# Altium project AMC_FMC_Carrier v4.PrjPcb (part 18 of 18)
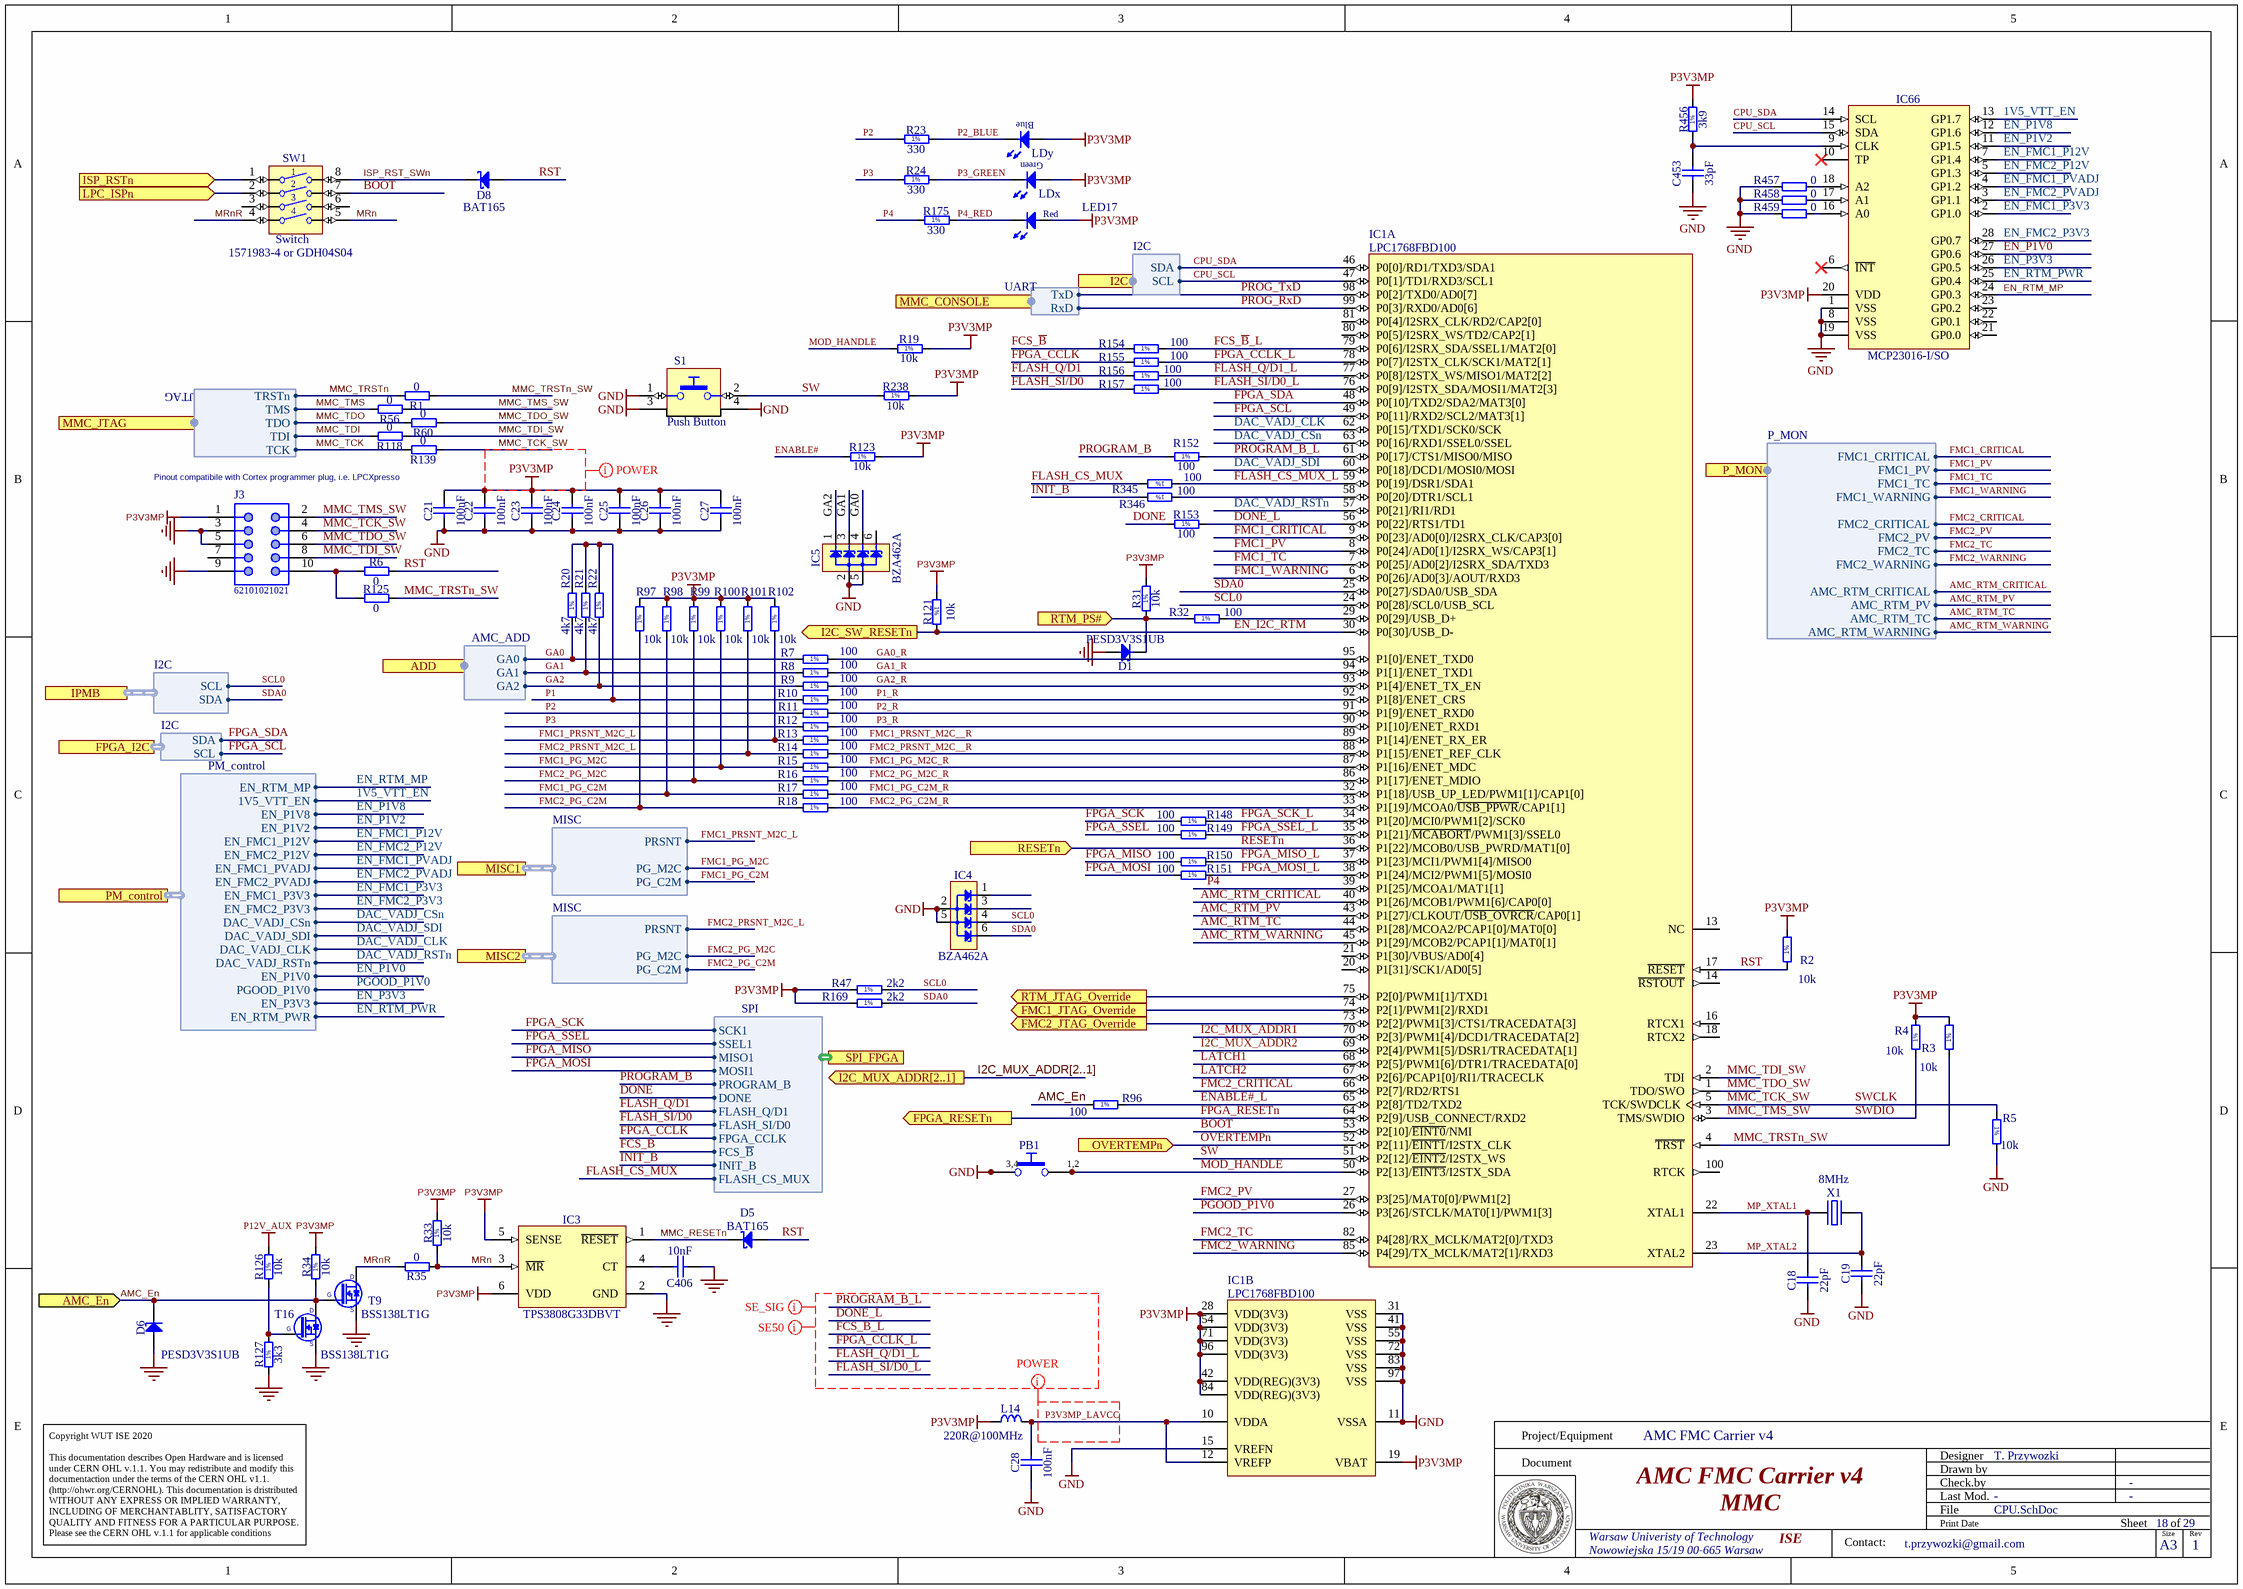
[diagram p31: CPU.SchDoc]

## Nets that join several sheets
FMC1_P3V3: HPC1 (10 pins), SUP_3.3_FMC (7 pins)
FMC2_P3V3: HPC2 (10 pins), SUP_3.3_FMC (7 pins)
GND: AMC_Connector (57 pins), HPC1 (182 pins), HPC2 (181 pins), FPGA (25 pins), FPGA_SDRAM (5 pins), FMC_HPC1 (16 pins), FMC_HPC2 (7 pins), FPGA_MGT (J18.2 J19.2 J20.2 J21.2), FPGA_SUP (499 pins), SDRAM (150 pins), POWER_Management (22 pins), SUP_2.5_FMC (38 pins), SUP_3.3_FMC (35 pins), SUP_1.5_3.3 (44 pins), SUP_1.2_1.8 (29 pins), SUP_1V (40 pins), UI_mon (10 pins), JTAG_Configuration (32 pins), RTM_CON (85 pins), M-LVDS PHY (64 pins), Clock_management (70 pins), Clock_WR (33 pins), AMC-SATA (6 pins), USB_SERIAL_QUAD (51 pins), I2C_MUX (7 pins), Thermometers (16 pins), RTCE (11 pins), CPU (45 pins)
MGTAVTT_G10: FPGA_MGT (R239.1), FPGA_SUP (21 pins)
MGTAVTT_G11: FPGA_MGT (R142.1), FPGA_SUP (21 pins)
P1V0: FPGA_SUP (123 pins), SUP_1V (24 pins)
P1V2: FPGA_SUP (FB7.1 FB8.1), SUP_1.2_1.8 (10 pins)
P1V5: FPGA_SUP (30 pins), SDRAM (108 pins), SUP_1.5_3.3 (12 pins), M-LVDS PHY (20 pins), Clock_management (C403.2 IC67.2 R439.1 R440.1)
P1V8: FPGA_SUP (L12.1), SUP_1.2_1.8 (10 pins)
P3V3: FPGA (26 pins), FMC_HPC1 (C102.1 LD1.4 R179.2), FPGA_SUP (C260.2 C261.2 IC2#2.L13 IC2#2.T11), POWER_Management (IC58.4 R268.2 R343.1 R344.1), SUP_1.5_3.3 (12 pins), JTAG_Configuration (18 pins), M-LVDS PHY (50 pins), Clock_management (7 pins), Clock_WR (8 pins), USB_SERIAL_QUAD (7 pins), I2C_MUX (11 pins)
P3V3_PMON: UI_mon (23 pins), I2C_MUX (R147.1 R265.1)
P3V3MP: AMC_Connector (P1.4), POWER_Management (6 pins), SUP_2.5_FMC (C475.2 C476.1 IC11.6 IC11.11), SUP_1.5_3.3 (R76.1), SUP_1.2_1.8 (R66.1 R77.1), SUP_1V (R110.2), UI_mon (L17.1), JTAG_Configuration (5 pins), USB_SERIAL_QUAD (IC61.1 R404.1 R405.2), I2C_MUX (8 pins), Thermometers (19 pins), RTCE (C38.1 C376.1 IC9.8 IC27.8), CPU (41 pins)
P12V: POWER_Management (18 pins), SUP_2.5_FMC (11 pins), SUP_3.3_FMC (11 pins), SUP_1.5_3.3 (11 pins), SUP_1.2_1.8 (6 pins), SUP_1V (18 pins)
P12V_AUX: POWER_Management (D7.2 D28.2 J4.3 J4.4), CPU (R126.2)
PAYLOAD_PWR: AMC_Connector (8 pins), POWER_Management (6 pins)
PVADJ1: HPC1 (8 pins), FPGA (6 pins), FMC_HPC1 (C100.1 IC25.2 R83.2 R178.2), FPGA_SUP (70 pins), SUP_2.5_FMC (6 pins)
PVADJ2: HPC2 (8 pins), FPGA (12 pins), FMC_HPC2 (R270.1), FPGA_SUP (69 pins), SUP_2.5_FMC (6 pins), Clock_management (7 pins)
VCCBATT: FPGA_SUP (BH1.1 C615.2 IC2#2.K13), RTCE (D4.2)
VREF: FPGA_SDRAM (8 pins), SDRAM (16 pins), SUP_1.5_3.3 (C548.2 IC44.6)
VTT: FPGA_SDRAM (R143.2 R181.2), SDRAM (40 pins), SUP_1.5_3.3 (5 pins)
3P3VAUX_R: AMC_FMC_Carrier (R124.2), HPC2 (J15B.c34)
ADD.GA0: AMC_Connector (P1.5), CPU (IC5.4 R7.1 R20.1)
ADD.GA1: AMC_Connector (P1.17), CPU (IC5.3 R8.1 R21.1)
ADD.GA2: AMC_Connector (P1.26), CPU (IC5.1 R9.1 R22.1)
AJTAG.TCK: AMC_Connector (P1.165), JTAG_Configuration (D12.1 IC46.9 R208.2)
AJTAG.TDI: AMC_Connector (P1.169), JTAG_Configuration (D10.1 IC46.4 R207.2)
AJTAG.TDO: AMC_Connector (P1.168), JTAG_Configuration (D13.1 IC46.7 R165.2)
AJTAG.TMS: AMC_Connector (P1.166), JTAG_Configuration (D11.1 IC46.12 R146.2)
AJTAG.TRST#: AMC_Connector (P1.167), JTAG_Configuration (D9.1 D14.1 R140.2 R229.2)
AMC_CLK_N: RTM_CON (J1.b3), Clock_management (R461.1)
AMC_CLK_P: RTM_CON (J1.a3), Clock_management (R460.1)
AMC_RTM_CRITICAL: UI_mon (R137.2 R465.1), CPU (IC1.40)
AMC_RTM_PV: UI_mon (R170.2 R464.1), CPU (IC1.43)
AMC_RTM_TC: UI_mon (R171.2 R463.1), CPU (IC1.44)
AMC_RTM_WARNING: UI_mon (R172.2 R462.1), CPU (IC1.45)
AMC_TCLK_N: RTM_CON (J1.b4), Clock_management (IC51#1.4)
AMC_TCLK_P: RTM_CON (J1.a4), Clock_management (IC51#1.3)
AUX_UART_Rx: FPGA (IC45.13), USB_SERIAL_QUAD (R396.1)
AUX_UART_Tx: FPGA (IC45.12), USB_SERIAL_QUAD (R398.1)
AUX_UART_VADJ2_Rx: FPGA (IC45.2), FMC_HPC2 (IC2#2.AD24 TP4.1)
AUX_UART_VADJ2_Tx: FPGA (IC45.3), FMC_HPC2 (IC2#2.AC24 TP13.1)
CLK2_BIDIR_N: HPC2 (J15B.k5), Clock_management (R355.1 R375.1)
CLK2_BIDIR_P: HPC2 (J15B.k4), Clock_management (R349.1 R376.1)
CLK3_BIDIR_N: HPC2 (J15B.j3), Clock_management (R366.1 R377.1)
CLK3_BIDIR_P: HPC2 (J15B.j2), Clock_management (R365.1 R378.1)
CLK_I2C.SCL: Clock_management (IC73.25), I2C_MUX (IC62.11 IC63.11 R424.2)
CLK_I2C.SDA: Clock_management (IC73.26), I2C_MUX (IC62.10 IC63.10 R423.2)
CLKS1.CLK0_M2C_N: HPC1 (J15A.h5), Clock_management (R360.1 R367.1)
CLKS1.CLK0_M2C_P: HPC1 (J15A.h4), Clock_management (R359.1 R368.1)
CLKS1.CLK1_M2C_N: HPC1 (J15A.g3), Clock_management (R299.1 R369.1)
CLKS1.CLK1_M2C_P: HPC1 (J15A.g2), Clock_management (R370.1 R443.1)
CLKS1.CLK2_BIDIR_N: HPC1 (J15A.k5), Clock_management (R362.1 R371.1)
CLKS1.CLK2_BIDIR_P: HPC1 (J15A.k4), Clock_management (R361.1 R372.1)
CLKS1.CLK3_BIDIR_N: HPC1 (J15A.j3), Clock_management (R364.1 R373.1)
CLKS1.CLK3_BIDIR_P: HPC1 (J15A.j2), Clock_management (R363.1 R374.1)
DP1.DP0_C2M_N: HPC1 (J15A.c3), FPGA_MGT (C179.1)
DP1.DP0_C2M_P: HPC1 (J15A.c2), FPGA_MGT (C178.1)
DP1.DP0_M2C_N: HPC1 (J15A.c7), FPGA_MGT (C181.1)
DP1.DP0_M2C_P: HPC1 (J15A.c6), FPGA_MGT (C180.1)
DP1.DP1_C2M_N: HPC1 (J15A.a23), FPGA_MGT (C185.1)
DP1.DP1_C2M_P: HPC1 (J15A.a22), FPGA_MGT (C184.1)
DP1.DP1_M2C_N: HPC1 (J15A.a3), FPGA_MGT (C187.1)
DP1.DP1_M2C_P: HPC1 (J15A.a2), FPGA_MGT (C186.1)
DP1.DP2_C2M_N: HPC1 (J15A.a27), FPGA_MGT (C191.1)
DP1.DP2_C2M_P: HPC1 (J15A.a26), FPGA_MGT (C190.1)
DP1.DP2_M2C_N: HPC1 (J15A.a7), FPGA_MGT (C193.1)
DP1.DP2_M2C_P: HPC1 (J15A.a6), FPGA_MGT (C192.1)
DP1.DP3_C2M_N: HPC1 (J15A.a31), FPGA_MGT (C195.1)
DP1.DP3_C2M_P: HPC1 (J15A.a30), FPGA_MGT (C194.1)
DP1.DP3_M2C_N: HPC1 (J15A.a11), FPGA_MGT (C197.1)
DP1.DP3_M2C_P: HPC1 (J15A.a10), FPGA_MGT (C196.1)
DP2.DP0_C2M_N: HPC2 (J15B.c3), FPGA_MGT (C199.1)
DP2.DP0_C2M_P: HPC2 (J15B.c2), FPGA_MGT (C198.1)
DP2.DP0_M2C_N: HPC2 (J15B.c7), FPGA_MGT (C201.1)
DP2.DP0_M2C_P: HPC2 (J15B.c6), FPGA_MGT (C200.1)
DP2.DP1_C2M_N: HPC2 (J15B.a23), FPGA_MGT (C205.1)
DP2.DP1_C2M_P: HPC2 (J15B.a22), FPGA_MGT (C204.1)
DP2.DP1_M2C_N: HPC2 (J15B.a3), FPGA_MGT (C207.1)
DP2.DP1_M2C_P: HPC2 (J15B.a2), FPGA_MGT (C206.1)
DP2.DP2_C2M_N: HPC2 (J15B.a27), FPGA_MGT (C629.1)
DP2.DP2_C2M_P: HPC2 (J15B.a26), FPGA_MGT (C627.1)
DP2.DP2_M2C_N: HPC2 (J15B.a7), FPGA_MGT (C633.1)
DP2.DP2_M2C_P: HPC2 (J15B.a6), FPGA_MGT (C631.1)
DP2.DP3_C2M_N: HPC2 (J15B.a31), FPGA_MGT (C628.1)
DP2.DP3_C2M_P: HPC2 (J15B.a30), FPGA_MGT (C626.1)
DP2.DP3_M2C_N: HPC2 (J15B.a11), FPGA_MGT (C632.1)
DP2.DP3_M2C_P: HPC2 (J15B.a10), FPGA_MGT (C630.1)
EN_I2C_RTM: I2C_MUX (IC63.24), CPU (IC1.30 R121.2)
EN_USB_JTAG: JTAG_Configuration (5 pins), USB_SERIAL_QUAD (T12.1)
FCLKA_N: AMC_Connector (P1.81), Clock_management (C776.1)
FCLKA_P: AMC_Connector (P1.80), Clock_management (C815.1)
FDDR.A0: FPGA_SDRAM (IC2#2.AP4), SDRAM (5 pins)
FDDR.A1: FPGA_SDRAM (IC2#2.AJ6), SDRAM (5 pins)
FDDR.A2: FPGA_SDRAM (IC2#2.AM4), SDRAM (5 pins)
FDDR.A3: FPGA_SDRAM (IC2#2.AM6), SDRAM (5 pins)
FDDR.A4: FPGA_SDRAM (IC2#2.AN4), SDRAM (5 pins)
FDDR.A5: FPGA_SDRAM (IC2#2.AK3), SDRAM (5 pins)
FDDR.A6: FPGA_SDRAM (IC2#2.AK5), SDRAM (5 pins)
FDDR.A7: FPGA_SDRAM (IC2#2.AP6), SDRAM (5 pins)
FDDR.A8: FPGA_SDRAM (IC2#2.AK6), SDRAM (5 pins)
FDDR.A9: FPGA_SDRAM (IC2#2.AL4), SDRAM (5 pins)
FDDR.A10: FPGA_SDRAM (IC2#2.AN2), SDRAM (5 pins)
FDDR.A11: FPGA_SDRAM (IC2#2.AJ8), SDRAM (5 pins)
FDDR.A12: FPGA_SDRAM (IC2#2.AP5), SDRAM (5 pins)
FDDR.A13: FPGA_SDRAM (IC2#2.AM7), SDRAM (5 pins)
FDDR.A14: FPGA_SDRAM (IC2#2.AK8), SDRAM (5 pins)
FDDR.A15: FPGA_SDRAM (IC2#2.AP3), SDRAM (5 pins)
FDDR.BA0: FPGA_SDRAM (IC2#2.AM2), SDRAM (5 pins)
FDDR.BA1: FPGA_SDRAM (IC2#2.AK2), SDRAM (5 pins)
FDDR.BA2: FPGA_SDRAM (IC2#2.AK1), SDRAM (5 pins)
FDDR.CAS_N: FPGA_SDRAM (IC2#2.AL2), SDRAM (5 pins)
FDDR.CE0_N: FPGA_SDRAM (IC2#2.AN3), SDRAM (5 pins)
FDDR.CKE0: FPGA_SDRAM (IC2#2.AJ5), SDRAM (5 pins)
FDDR.CLK0_N: FPGA_SDRAM (IC2#2.AM5), SDRAM (5 pins)
FDDR.CLK0_P: FPGA_SDRAM (IC2#2.AL5), SDRAM (5 pins)
FDDR.D0: FPGA_SDRAM (IC2#2.AD11), SDRAM (IC24.B3)
FDDR.D1: FPGA_SDRAM (IC2#2.AE10), SDRAM (IC24.C7)
FDDR.D2: FPGA_SDRAM (IC2#2.AF12), SDRAM (IC24.C2)
FDDR.D3: FPGA_SDRAM (IC2#2.AG11), SDRAM (IC24.C8)
FDDR.D4: FPGA_SDRAM (IC2#2.AE11), SDRAM (IC24.E3)
FDDR.D5: FPGA_SDRAM (IC2#2.AH11), SDRAM (IC24.E8)
FDDR.D6: FPGA_SDRAM (IC2#2.AG12), SDRAM (IC24.D2)
FDDR.D7: FPGA_SDRAM (IC2#2.AH9), SDRAM (IC24.E7)
FDDR.D8: FPGA_SDRAM (IC2#2.AD6), SDRAM (IC16.B3)
FDDR.D9: FPGA_SDRAM (IC2#2.AG7), SDRAM (IC16.C7)
FDDR.D10: FPGA_SDRAM (IC2#2.AF9), SDRAM (IC16.C2)
FDDR.D11: FPGA_SDRAM (IC2#2.AH7), SDRAM (IC16.C8)
FDDR.D12: FPGA_SDRAM (IC2#2.AE8), SDRAM (IC16.E3)
FDDR.D13: FPGA_SDRAM (IC2#2.AF8), SDRAM (IC16.E8)
FDDR.D14: FPGA_SDRAM (IC2#2.AE7), SDRAM (IC16.D2)
FDDR.D15: FPGA_SDRAM (IC2#2.AF7), SDRAM (IC16.E7)
FDDR.D16: FPGA_SDRAM (IC2#2.AF4), SDRAM (IC26.B3)
FDDR.D17: FPGA_SDRAM (IC2#2.AF5), SDRAM (IC26.C7)
FDDR.D18: FPGA_SDRAM (IC2#2.AD3), SDRAM (IC26.C2)
FDDR.D19: FPGA_SDRAM (IC2#2.AG5), SDRAM (IC26.C8)
FDDR.D20: FPGA_SDRAM (IC2#2.AD5), SDRAM (IC26.E3)
FDDR.D21: FPGA_SDRAM (IC2#2.AG6), SDRAM (IC26.E8)
FDDR.D22: FPGA_SDRAM (IC2#2.AD4), SDRAM (IC26.D2)
FDDR.D23: FPGA_SDRAM (IC2#2.AE3), SDRAM (IC26.E7)
FDDR.D24: FPGA_SDRAM (IC2#2.AG1), SDRAM (IC15.B3)
FDDR.D25: FPGA_SDRAM (IC2#2.AG2), SDRAM (IC15.C7)
FDDR.D26: FPGA_SDRAM (IC2#2.AE1), SDRAM (IC15.C2)
FDDR.D27: FPGA_SDRAM (IC2#2.AF3), SDRAM (IC15.C8)
FDDR.D28: FPGA_SDRAM (IC2#2.AE2), SDRAM (IC15.E3)
FDDR.D29: FPGA_SDRAM (IC2#2.AH3), SDRAM (IC15.E8)
FDDR.D30: FPGA_SDRAM (IC2#2.AD1), SDRAM (IC15.D2)
FDDR.D31: FPGA_SDRAM (IC2#2.AF2), SDRAM (IC15.E7)
FDDR.DQM0: FPGA_SDRAM (IC2#2.AD10), SDRAM (IC24.B7)
FDDR.DQM1: FPGA_SDRAM (IC2#2.AH6), SDRAM (IC16.B7)
FDDR.DQM2: FPGA_SDRAM (IC2#2.AG4), SDRAM (IC26.B7)
FDDR.DQM3: FPGA_SDRAM (IC2#2.AH1), SDRAM (IC15.B7)
FDDR.DQS0_N: FPGA_SDRAM (IC2#2.AG9), SDRAM (IC24.D3)
FDDR.DQS0_P: FPGA_SDRAM (IC2#2.AG10), SDRAM (IC24.C3)
FDDR.DQS1_N: FPGA_SDRAM (IC2#2.AD8), SDRAM (IC16.D3)
FDDR.DQS1_P: FPGA_SDRAM (IC2#2.AD9), SDRAM (IC16.C3)
FDDR.DQS2_N: FPGA_SDRAM (IC2#2.AJ4), SDRAM (IC26.D3)
FDDR.DQS2_P: FPGA_SDRAM (IC2#2.AH4), SDRAM (IC26.C3)
FDDR.DQS3_N: FPGA_SDRAM (IC2#2.AJ1), SDRAM (IC15.D3)
FDDR.DQS3_P: FPGA_SDRAM (IC2#2.AH2), SDRAM (IC15.C3)
FDDR.ODT0: FPGA_SDRAM (IC2#2.AP1), SDRAM (5 pins)
FDDR.RAS_N: FPGA_SDRAM (IC2#2.AN1), SDRAM (5 pins)
FDDR.RST_N: FPGA_SDRAM (IC2#2.AJ9), SDRAM (5 pins)
FDDR.WE_N: FPGA_SDRAM (IC2#2.AM1), SDRAM (5 pins)
FJTAG.TCK: FPGA (IC2#1.AE12), JTAG_Configuration (IC47.17 R164.1 R212.1)
FJTAG.TDI: FPGA (IC2#1.AE14), JTAG_Configuration (R209.1)
FJTAG.TDO: FPGA (IC2#1.AD13), JTAG_Configuration (R210.1 R235.2)
FJTAG.TMS: FPGA (IC2#1.AE13), JTAG_Configuration (IC47.11 R225.1 R436.1)
FLASH_CLK_C: FPGA (IC69.5), FMC_HPC1 (IC2#2.J8)
FMC1_CRITICAL: UI_mon (R173.2 R276.1), CPU (IC1.9)
FMC1_JTAG_Override: JTAG_Configuration (D22.2), CPU (IC1.74)
FMC1_PV: UI_mon (R174.2 R275.1), CPU (IC1.8)
FMC1_TC: UI_mon (R176.2 R274.1), CPU (IC1.7)
FMC1_WARNING: UI_mon (R273.2 R470.1), CPU (IC1.6)
FMC2_CRITICAL: UI_mon (R284.2 R469.1), CPU (IC1.66)
FMC2_JTAG_Override: JTAG_Configuration (D24.2), CPU (IC1.73)
FMC2_PV: UI_mon (R285.2 R468.1), CPU (IC1.27)
FMC2_TC: UI_mon (R313.2 R467.1), CPU (IC1.82)
FMC2_WARNING: UI_mon (R314.2 R466.1), CPU (IC1.85)
FMCC2.CLK0_M2C_N: HPC2 (J15B.h5), FMC_HPC2 (IC2#2.AB30)
FMCC2.CLK0_M2C_P: HPC2 (J15B.h4), FMC_HPC2 (IC2#2.AA30)
FMCC2.CLK1_M2C_N: HPC2 (J15B.g3), FMC_HPC2 (IC2#2.AG30)
FMCC2.CLK1_M2C_P: HPC2 (J15B.g2), FMC_HPC2 (IC2#2.AG29)
FMCC2.CLK2_BIDIR_N: FMC_HPC2 (IC2#2.AH29), Clock_management (R375.2)
FMCC2.CLK2_BIDIR_P: FMC_HPC2 (IC2#2.AH28), Clock_management (R376.2)
FMCC2.CLK3_BIDIR_N: FMC_HPC2 (IC2#2.Y31), Clock_management (R377.2)
FMCC2.CLK3_BIDIR_P: FMC_HPC2 (IC2#2.Y30), Clock_management (R378.2)
FPGA_CLK1_N: FPGA_MGT (C799.1), RTM_CON (J2.b5)
FPGA_CLK1_P: FPGA_MGT (C797.1), RTM_CON (J2.a5)
FPGA_CLK2_N: FPGA_MGT (C794.1), RTM_CON (J2.b9)
FPGA_CLK2_P: FPGA_MGT (C792.1), RTM_CON (J2.a9)
FPGA_CLK.BOOT_CLK_IN: FPGA_SDRAM (R311.2), Clock_WR (R51.2 R382.2)
FPGA_CLK.FPGA_CLK1_N: FPGA_SDRAM (IC2#2.AL7 R143.1), Clock_management (IC73.82)
FPGA_CLK.FPGA_CLK1_P: FPGA_SDRAM (IC2#2.AK7 R181.1), Clock_management (IC73.81)
FPGA_I2C_RST: FPGA (IC13.13), I2C_MUX (IC62.24 R417.2)
FPGA_I2C_SCL: FMC_HPC1 (IC25.6), I2C_MUX (B10.1 IC62.19 R412.1), CPU (IC1.49)
FPGA_I2C_SDA: FMC_HPC1 (IC25.5), I2C_MUX (B9.1 IC62.20 R411.1), CPU (IC1.48)
FPGA_RESETn: FMC_HPC2 (D3.1), CPU (IC1.64)
FSPI.DONE: FPGA (IC2#1.P11 Q9.1 R161.1), CPU (R153.2)
FSPI.FCS_~{B}: FPGA (IC13.12 R351.1), CPU (R154.1)
FSPI.FLASH_D2: FPGA (IC13.4), FMC_HPC2 (IC2#2.V26)
FSPI.FLASH_D3: FPGA (IC13.5), FMC_HPC2 (IC2#2.V27)
FSPI.FLASH_FCS_~{B}: FPGA (IC13.3), FMC_HPC2 (IC2#2.Y27)
FSPI.FLASH_Q/D1: FPGA (IC17.12 R298.2), CPU (R156.1)
FSPI.FLASH_Q/D1: FPGA (IC17.3), FMC_HPC2 (IC2#2.V29)
FSPI.FLASH_SI/D0: FPGA (IC17.13 R291.1), CPU (R157.1)
FSPI.FLASH_SI/D0: FPGA (IC17.2), FMC_HPC2 (IC2#2.V28)
FSPI.FPGA_CCLK: FPGA (IC2#1.W11 R294.1), CPU (R155.1)
FSPI.INIT_B: FPGA (IC2#1.V11 R131.2), CPU (R346.1)
FSPI.MISO1: FPGA (R296.2), CPU (R150.2)
FSPI.MOSI1: FPGA (R292.1), CPU (R151.2)
FSPI.PROGRAM_B: FPGA (IC2#1.N11 R160.1), CPU (R152.2)
FSPI.SCK1: FPGA (R295.1), CPU (R148.2)
FSPI.SSEL1: FPGA (R300.1), CPU (R149.2)
GBT1.GBTCLK0_M2C_N: HPC1 (J15A.d5), FPGA_MGT (C183.1)
GBT1.GBTCLK0_M2C_P: HPC1 (J15A.d4), FPGA_MGT (C182.1)
GBT1.GBTCLK1_M2C_N: HPC1 (J15A.b21), FPGA_MGT (C189.1)
GBT1.GBTCLK1_M2C_P: HPC1 (J15A.b20), FPGA_MGT (C188.1)
GBT2.GBTCLK0_M2C_N: HPC2 (J15B.d5), FPGA_MGT (C203.1)
GBT2.GBTCLK0_M2C_P: HPC2 (J15B.d4), FPGA_MGT (C202.1)
GBT2.GBTCLK1_M2C_N: HPC2 (J15B.b21), FPGA_MGT (C841.1)
GBT2.GBTCLK1_M2C_P: HPC2 (J15B.b20), FPGA_MGT (C840.1)
HA1.HA00_CC_N: HPC1 (J15A.f5), FMC_HPC1 (IC2#2.H29)
HA1.HA00_CC_P: HPC1 (J15A.f4), FMC_HPC1 (IC2#2.J29)
HA1.HA01_CC_N: HPC1 (J15A.e3), FMC_HPC1 (IC2#2.K28)
HA1.HA01_CC_P: HPC1 (J15A.e2), FMC_HPC1 (IC2#2.L28)
HA1.HA02_N: HPC1 (J15A.k8), FMC_HPC1 (IC2#2.J34)
HA1.HA02_P: HPC1 (J15A.k7), FMC_HPC1 (IC2#2.K33)
HA1.HA03_N: HPC1 (J15A.j7), FMC_HPC1 (IC2#2.J30)
HA1.HA03_P: HPC1 (J15A.j6), FMC_HPC1 (IC2#2.K30)
HA1.HA04_N: HPC1 (J15A.f8), FMC_HPC1 (IC2#2.L34)
HA1.HA04_P: HPC1 (J15A.f7), FMC_HPC1 (IC2#2.L33)
HA1.HA05_N: HPC1 (J15A.e7), FMC_HPC1 (IC2#2.H34)
HA1.HA05_P: HPC1 (J15A.e6), FMC_HPC1 (IC2#2.J33)
HA1.HA06_N: HPC1 (J15A.k11), FMC_HPC1 (IC2#2.K27)
HA1.HA06_P: HPC1 (J15A.k10), FMC_HPC1 (IC2#2.L27)
HA1.HA07_N: HPC1 (J15A.j10), FMC_HPC1 (IC2#2.K32)
HA1.HA07_P: HPC1 (J15A.j9), FMC_HPC1 (IC2#2.L32)
HA1.HA08_N: HPC1 (J15A.f11), FMC_HPC1 (IC2#2.L30)
HA1.HA08_P: HPC1 (J15A.f10), FMC_HPC1 (IC2#2.L29)
HA1.HA09_N: HPC1 (J15A.e10), FMC_HPC1 (IC2#2.J31)
HA1.HA09_P: HPC1 (J15A.e9), FMC_HPC1 (IC2#2.K31)
HA1.HA10_N: HPC1 (J15A.k14), FMC_HPC1 (IC2#2.G32)
HA1.HA10_P: HPC1 (J15A.k13), FMC_HPC1 (IC2#2.H32)
HA1.HA11_N: HPC1 (J15A.j13), FMC_HPC1 (IC2#2.L25)
HA1.HA11_P: HPC1 (J15A.j12), FMC_HPC1 (IC2#2.M25)
HA1.HA12_N: HPC1 (J15A.f14), FMC_HPC1 (IC2#2.G34)
HA1.HA12_P: HPC1 (J15A.f13), FMC_HPC1 (IC2#2.H33)
HA1.HA13_N: HPC1 (J15A.e13), FMC_HPC1 (IC2#2.J25)
HA1.HA13_P: HPC1 (J15A.e12), FMC_HPC1 (IC2#2.K25)
HA1.HA14_N: HPC1 (J15A.j16), FMC_HPC1 (IC2#2.L24)
HA1.HA14_P: HPC1 (J15A.j15), FMC_HPC1 (IC2#2.M24)
HA1.HA15_N: HPC1 (J15A.f17), FMC_HPC1 (IC2#2.G30)
HA1.HA15_P: HPC1 (J15A.f16), FMC_HPC1 (IC2#2.G29)
HA1.HA16_N: HPC1 (J15A.e16), FMC_HPC1 (IC2#2.G31)
HA1.HA16_P: HPC1 (J15A.e15), FMC_HPC1 (IC2#2.H31)
HA1.HA17_CC_N: HPC1 (J15A.k17), FMC_HPC1 (IC2#2.H28)
HA1.HA17_CC_P: HPC1 (J15A.k16), FMC_HPC1 (IC2#2.J28)
HA1.HA18_N: HPC1 (J15A.j19), FMC_HPC1 (IC2#2.G27)
HA1.HA18_P: HPC1 (J15A.j18), FMC_HPC1 (IC2#2.H27)
HA1.HA19_N: HPC1 (J15A.f20), FMC_HPC1 (IC2#2.G26)
HA1.HA19_P: HPC1 (J15A.f19), FMC_HPC1 (IC2#2.H26)
HA1.HA20_N: HPC1 (J15A.e19), FMC_HPC1 (IC2#2.J26)
HA1.HA20_P: HPC1 (J15A.e18), FMC_HPC1 (IC2#2.K26)
HA1.HA21_N: HPC1 (J15A.k20), FMC_HPC1 (IC2#2.G25)
HA1.HA21_P: HPC1 (J15A.k19), FMC_HPC1 (IC2#2.G24)
HA1.HA22_N: HPC1 (J15A.j22), FMC_HPC1 (IC2#2.H24)
HA1.HA22_P: HPC1 (J15A.j21), FMC_HPC1 (IC2#2.J24)
HA1.HA23_N: HPC1 (J15A.k23), FMC_HPC1 (IC2#2.J23)
HA1.HA23_P: HPC1 (J15A.k22), FMC_HPC1 (IC2#2.K23)
HA2.HA00_CC_N: HPC2 (J15B.f5), FMC_HPC2 (R245#1.16)
HA2.HA00_CC_P: HPC2 (J15B.f4), FMC_HPC2 (R245#1.15)
HA2.HA01_CC_N: HPC2 (J15B.e3), FMC_HPC2 (R245#1.14)
HA2.HA01_CC_P: HPC2 (J15B.e2), FMC_HPC2 (R245#1.13)
HA2.HA02_N: HPC2 (J15B.k8), FMC_HPC2 (R245#1.12)
HA2.HA02_P: HPC2 (J15B.k7), FMC_HPC2 (R245#1.11)
HA2.HA03_N: HPC2 (J15B.j7), FMC_HPC2 (R245#1.10)
HA2.HA03_P: HPC2 (J15B.j6), FMC_HPC2 (R245#1.9)
HA2.HA04_N: HPC2 (J15B.f8), FMC_HPC2 (R250#1.16)
HA2.HA04_P: HPC2 (J15B.f7), FMC_HPC2 (R250#1.15)
HA2.HA05_N: HPC2 (J15B.e7), FMC_HPC2 (R250#1.14)
HA2.HA05_P: HPC2 (J15B.e6), FMC_HPC2 (R250#1.13)
HA2.HA06_N: HPC2 (J15B.k11), FMC_HPC2 (R250#1.12)
HA2.HA06_P: HPC2 (J15B.k10), FMC_HPC2 (R250#1.11)
HA2.HA07_N: HPC2 (J15B.j10), FMC_HPC2 (R250#1.10)
HA2.HA07_P: HPC2 (J15B.j9), FMC_HPC2 (R250#1.9)
HA2.HA08_N: HPC2 (J15B.f11), FMC_HPC2 (R252#1.16)
HA2.HA08_P: HPC2 (J15B.f10), FMC_HPC2 (R252#1.15)
HA2.HA09_N: HPC2 (J15B.e10), FMC_HPC2 (R252#1.14)
HA2.HA09_P: HPC2 (J15B.e9), FMC_HPC2 (R252#1.13)
HA2.HA10_N: HPC2 (J15B.k14), FMC_HPC2 (R252#1.12)
HA2.HA10_P: HPC2 (J15B.k13), FMC_HPC2 (R252#1.11)
HA2.HA11_N: HPC2 (J15B.j13), FMC_HPC2 (R252#1.10)
HA2.HA11_P: HPC2 (J15B.j12), FMC_HPC2 (R252#1.9)
HA2.HA12_N: HPC2 (J15B.f14), FMC_HPC2 (R254#1.16)
HA2.HA12_P: HPC2 (J15B.f13), FMC_HPC2 (R254#1.15)
HA2.HA13_N: HPC2 (J15B.e13), FMC_HPC2 (R254#1.14)
HA2.HA13_P: HPC2 (J15B.e12), FMC_HPC2 (R254#1.13)
HA2.HA14_N: HPC2 (J15B.j16), FMC_HPC2 (IC2#2.AP34)
HA2.HA14_P: HPC2 (J15B.j15), FMC_HPC2 (IC2#2.AN34)
HA2.HA15_N: HPC2 (J15B.f17), FMC_HPC2 (IC2#2.AK30)
HA2.HA15_P: HPC2 (J15B.f16), FMC_HPC2 (IC2#2.AJ29)
HA2.HA16_N: HPC2 (J15B.e16), FMC_HPC2 (IC2#2.AL27)
HA2.HA16_P: HPC2 (J15B.e15), FMC_HPC2 (IC2#2.AK27)
HA2.HA17_CC_N: HPC2 (J15B.k17), FMC_HPC2 (IC2#2.AK28)
HA2.HA17_CC_P: HPC2 (J15B.k16), FMC_HPC2 (IC2#2.AJ28)
HA2.HA18_N: HPC2 (J15B.j19), FMC_HPC2 (IC2#2.AP33)
HA2.HA18_P: HPC2 (J15B.j18), FMC_HPC2 (IC2#2.AN33)
HA2.HA19_N: HPC2 (J15B.f20), FMC_HPC2 (IC2#2.AK31)
HA2.HA19_P: HPC2 (J15B.f19), FMC_HPC2 (IC2#2.AJ30)
HA2.HA20_N: HPC2 (J15B.e19), FMC_HPC2 (IC2#2.AK32)
HA2.HA20_P: HPC2 (J15B.e18), FMC_HPC2 (IC2#2.AJ31)
HA2.HA21_N: HPC2 (J15B.k20), FMC_HPC2 (IC2#2.AP30)
HA2.HA21_P: HPC2 (J15B.k19), FMC_HPC2 (IC2#2.AP29)
HA2.HA22_N: HPC2 (J15B.j22), FMC_HPC2 (IC2#2.AM34)
HA2.HA22_P: HPC2 (J15B.j21), FMC_HPC2 (IC2#2.AL34)
HA2.HA23_N: HPC2 (J15B.k23), FMC_HPC2 (IC2#2.AJ34)
HA2.HA23_P: HPC2 (J15B.k22), FMC_HPC2 (IC2#2.AJ33)
HB1.HB00_CC_N: HPC1 (J15A.k26), FMC_HPC1 (IC2#2.Y5)
HB1.HB00_CC_P: HPC1 (J15A.k25), FMC_HPC1 (IC2#2.W5)
HB1.HB01_N: HPC1 (J15A.j25), FMC_HPC1 (IC2#2.W8)
HB1.HB01_P: HPC1 (J15A.j24), FMC_HPC1 (IC2#2.W9)
HB1.HB02_N: HPC1 (J15A.f23), FMC_HPC1 (IC2#2.V8)
HB1.HB02_P: HPC1 (J15A.f22), FMC_HPC1 (IC2#2.V9)
HB1.HB03_N: HPC1 (J15A.e22), FMC_HPC1 (IC2#2.Y10)
HB1.HB03_P: HPC1 (J15A.e21), FMC_HPC1 (IC2#2.W10)
HB1.HB04_N: HPC1 (J15A.f26), FMC_HPC1 (IC2#2.Y7)
HB1.HB04_P: HPC1 (J15A.f25), FMC_HPC1 (IC2#2.Y8)
HB1.HB05_N: HPC1 (J15A.e25), FMC_HPC1 (IC2#2.AA9)
HB1.HB05_P: HPC1 (J15A.e24), FMC_HPC1 (IC2#2.AA10)
HB1.HB06_CC_N: HPC1 (J15A.k29), FMC_HPC1 (IC2#2.W4)
HB1.HB06_CC_P: HPC1 (J15A.k28), FMC_HPC1 (IC2#2.V4)
HB1.HB07_N: HPC1 (J15A.j28), FMC_HPC1 (IC2#2.AB9)
HB1.HB07_P: HPC1 (J15A.j27), FMC_HPC1 (IC2#2.AB10)
HB1.HB08_N: HPC1 (J15A.f29), FMC_HPC1 (IC2#2.W3)
HB1.HB08_P: HPC1 (J15A.f28), FMC_HPC1 (IC2#2.V3)
HB1.HB09_N: HPC1 (J15A.e28), FMC_HPC1 (IC2#2.V1)
HB1.HB09_P: HPC1 (J15A.e27), FMC_HPC1 (IC2#2.V2)
HB1.HB10_N: HPC1 (J15A.k32), FMC_HPC1 (IC2#2.V6)
HB1.HB10_P: HPC1 (J15A.k31), FMC_HPC1 (IC2#2.V7)
HB1.HB11_N: HPC1 (J15A.j31), FMC_HPC1 (IC2#2.Y1)
HB1.HB11_P: HPC1 (J15A.j30), FMC_HPC1 (IC2#2.W1)
HB1.HB12_N: HPC1 (J15A.f32), FMC_HPC1 (IC2#2.AC6)
HB1.HB12_P: HPC1 (J15A.f31), FMC_HPC1 (IC2#2.AC7)
HB1.HB13_N: HPC1 (J15A.e31), FMC_HPC1 (IC2#2.Y2)
HB1.HB13_P: HPC1 (J15A.e30), FMC_HPC1 (IC2#2.Y3)
HB1.HB14_N: HPC1 (J15A.k35), FMC_HPC1 (IC2#2.AC1)
HB1.HB14_P: HPC1 (J15A.k34), FMC_HPC1 (IC2#2.AC2)
HB1.HB15_N: HPC1 (J15A.j34), FMC_HPC1 (IC2#2.AC8)
HB1.HB15_P: HPC1 (J15A.j33), FMC_HPC1 (IC2#2.AC9)
HB1.HB16_N: HPC1 (J15A.f35), FMC_HPC1 (IC2#2.AB1)
HB1.HB16_P: HPC1 (J15A.f34), FMC_HPC1 (IC2#2.AB2)
HB1.HB17_CC_N: HPC1 (J15A.k38), FMC_HPC1 (IC2#2.AA4)
HB1.HB17_CC_P: HPC1 (J15A.k37), FMC_HPC1 (IC2#2.AA5)
HB1.HB18_N: HPC1 (J15A.j37), FMC_HPC1 (IC2#2.AB6)
HB1.HB18_P: HPC1 (J15A.j36), FMC_HPC1 (IC2#2.AB7)
HB1.HB19_N: HPC1 (J15A.e34), FMC_HPC1 (IC2#2.AB4)
HB1.HB19_P: HPC1 (J15A.e33), FMC_HPC1 (IC2#2.AB5)
HB1.HB20_N: HPC1 (J15A.f38), FMC_HPC1 (IC2#2.AA2)
HB1.HB20_P: HPC1 (J15A.f37), FMC_HPC1 (IC2#2.AA3)
HB1.HB21_N: HPC1 (J15A.e37), FMC_HPC1 (IC2#2.AC3)
HB1.HB21_P: HPC1 (J15A.e36), FMC_HPC1 (IC2#2.AC4)
HB2.HB00_CC_N: HPC2 (J15B.k26), FMC_HPC2 (R243.16)
HB2.HB00_CC_P: HPC2 (J15B.k25), FMC_HPC2 (R243.15)
HB2.HB01_N: HPC2 (J15B.j25), FMC_HPC2 (R243.14)
HB2.HB01_P: HPC2 (J15B.j24), FMC_HPC2 (R243.13)
HB2.HB02_N: HPC2 (J15B.f23), FMC_HPC2 (R243.12)
HB2.HB02_P: HPC2 (J15B.f22), FMC_HPC2 (R243.11)
HB2.HB03_N: HPC2 (J15B.e22), FMC_HPC2 (R243.10)
HB2.HB03_P: HPC2 (J15B.e21), FMC_HPC2 (R243.9)
HB2.HB04_N: HPC2 (J15B.f26), FMC_HPC2 (R387.16)
HB2.HB04_P: HPC2 (J15B.f25), FMC_HPC2 (R387.15)
HB2.HB05_N: HPC2 (J15B.e25), FMC_HPC2 (R387.14)
HB2.HB05_P: HPC2 (J15B.e24), FMC_HPC2 (R387.13)
HB2.HB06_CC_N: HPC2 (J15B.k29), FMC_HPC2 (R387.12)
HB2.HB06_CC_P: HPC2 (J15B.k28), FMC_HPC2 (R387.11)
HB2.HB07_N: HPC2 (J15B.j28), FMC_HPC2 (R387.10)
HB2.HB07_P: HPC2 (J15B.j27), FMC_HPC2 (R387.9)
HB2.HB08_N: HPC2 (J15B.f29), FMC_HPC2 (R389.16)
HB2.HB08_P: HPC2 (J15B.f28), FMC_HPC2 (R389.15)
HB2.HB09_N: HPC2 (J15B.e28), FMC_HPC2 (R389.14)
HB2.HB09_P: HPC2 (J15B.e27), FMC_HPC2 (R389.13)
HB2.HB10_N: HPC2 (J15B.k32), FMC_HPC2 (R389.12)
HB2.HB10_P: HPC2 (J15B.k31), FMC_HPC2 (R389.11)
HB2.HB11_N: HPC2 (J15B.j31), FMC_HPC2 (R389.10)
HB2.HB11_P: HPC2 (J15B.j30), FMC_HPC2 (R389.9)
HB2.HB12_N: HPC2 (J15B.f32), FMC_HPC2 (R391.16)
HB2.HB12_P: HPC2 (J15B.f31), FMC_HPC2 (R391.15)
HB2.HB13_N: HPC2 (J15B.e31), FMC_HPC2 (R391.14)
HB2.HB13_P: HPC2 (J15B.e30), FMC_HPC2 (R391.13)
HB2.HB14_N: HPC2 (J15B.k35), FMC_HPC2 (R391.12)
HB2.HB14_P: HPC2 (J15B.k34), FMC_HPC2 (R391.11)
HB2.HB15_N: HPC2 (J15B.j34), FMC_HPC2 (R391.10)
HB2.HB15_P: HPC2 (J15B.j33), FMC_HPC2 (R391.9)
HB2.HB16_N: HPC2 (J15B.f35), FMC_HPC2 (IC2#2.U32)
HB2.HB16_P: HPC2 (J15B.f34), FMC_HPC2 (IC2#2.U31)
HB2.HB17_CC_N: HPC2 (J15B.k38), FMC_HPC2 (R393.2)
HB2.HB17_CC_P: HPC2 (J15B.k37), FMC_HPC2 (R446.2)
HB2.HB18_N: HPC2 (J15B.j37), FMC_HPC2 (IC2#2.M29)
HB2.HB18_P: HPC2 (J15B.j36), FMC_HPC2 (IC2#2.N29)
HB2.HB19_N: HPC2 (J15B.e34), FMC_HPC2 (IC2#2.M31)
HB2.HB19_P: HPC2 (J15B.e33), FMC_HPC2 (IC2#2.M30)
Helper_OE: FPGA (Q14.3), Clock_WR (OSC3.2 R379.1)
Helper_OE_C: FPGA (R136.1), FPGA_SDRAM (IC2#2.AN6)
Helper_SCL: FPGA_SDRAM (IC2#2.AN7), Clock_management (IC67.3 R440.2)
Helper_SDA: FPGA_SDRAM (IC2#2.AC11), Clock_management (IC67.4 R439.2)
Helper_SI57X_SCL: Clock_management (IC67.6), Clock_WR (OSC3.8 R380.1)
Helper_SI57X_SDA: Clock_management (IC67.5), Clock_WR (OSC3.7 R381.1)
Helper_TUNE: Clock_management (IC41.15), Clock_WR (R383.2 R384.2)
I2C1.SCL: HPC1 (J15A.c30), I2C_MUX (IC62.17 IC63.17 R430.2)
I2C1.SDA: HPC1 (J15A.c31), I2C_MUX (IC62.16 IC63.16 R429.2)
I2C2.SCL: HPC2 (J15B.c30), I2C_MUX (IC62.15 IC63.15 R428.2)
I2C2.SDA: HPC2 (J15B.c31), I2C_MUX (IC62.14 IC63.14 R427.2)
I2C_CPU.SCL: I2C_MUX (B12.1 IC63.19 R432.1), CPU (IC1.47 IC66.15)
I2C_CPU.SDA: I2C_MUX (B11.1 IC63.20 R431.1), CPU (IC1.46 IC66.14)
I2C_FPGA_RST_C: FPGA (IC13.2), FMC_HPC2 (IC2#2.AD31)
I2C_MUX_ADDR1: I2C_MUX (R420.1 R434.1), CPU (IC1.70)
I2C_MUX_ADDR2: I2C_MUX (R418.1 R433.1), CPU (IC1.69)
I_AMC_P12V0+: POWER_Management (R?#4.E1), UI_mon (IC6.12)
I_AMC_P12V0-: POWER_Management (R?#4.E2), UI_mon (IC6.11)
I_FMC1_P3V3n: SUP_3.3_FMC (R94.E2), UI_mon (IC7.11)
I_FMC1_P3V3p: SUP_3.3_FMC (R94.E1), UI_mon (IC7.12)
I_FMC1_P12V0+: POWER_Management (R266.E1), UI_mon (IC7.15)
I_FMC1_P12V0-: POWER_Management (R266.E2), UI_mon (IC7.14)
I_FMC1_PADJn: SUP_2.5_FMC (R257.E2), UI_mon (IC7.1)
I_FMC1_PADJp: SUP_2.5_FMC (R257.E1), UI_mon (IC7.2)
I_FMC2_P3V3n: SUP_3.3_FMC (R89.E2), UI_mon (IC8.11)
I_FMC2_P3V3p: SUP_3.3_FMC (R89.E1), UI_mon (IC8.12)
I_FMC2_P12V0+: POWER_Management (R267.E1), UI_mon (IC8.15)
I_FMC2_P12V0-: POWER_Management (R267.E2), UI_mon (IC8.14)
I_FMC2_PADJn: SUP_2.5_FMC (R75.E2), UI_mon (IC8.1)
I_FMC2_PADJp: SUP_2.5_FMC (R75.E1), UI_mon (IC8.2)
I_RTM_P12V0+: POWER_Management (R68.E1), UI_mon (IC6.15)
I_RTM_P12V0-: POWER_Management (R68.E2), UI_mon (IC6.1 IC6.14)
IPMB.SCL: AMC_Connector (P1.56), CPU (IC1.24 IC4.4 R47.2)
IPMB.SDA: AMC_Connector (P1.71), CPU (IC1.25 IC4.6 R169.2)
ISP_RSTn: USB_SERIAL_QUAD (T13.3), CPU (SW1.1)
JTAG1.TCK: HPC1 (J15A.d29), JTAG_Configuration (IC47.16)
JTAG1.TDI: HPC1 (J15A.d30), JTAG_Configuration (IC49.1 R235.1)
JTAG1.TDO: HPC1 (J15A.d31), JTAG_Configuration (IC49.3)
JTAG1.TMS: HPC1 (J15A.d33), JTAG_Configuration (IC47.13)
JTAG2.TCK: HPC2 (J15B.d29), JTAG_Configuration (IC47.18)
JTAG2.TDI: HPC2 (J15B.d30), JTAG_Configuration (IC49.4 IC72.1)
JTAG2.TDO: HPC2 (J15B.d31), JTAG_Configuration (IC72.3)
JTAG2.TMS: HPC2 (J15B.d33), JTAG_Configuration (IC47.14)
LA1.LA00_CC_N: HPC1 (J15A.g7), FMC_HPC1 (IC2#2.K6)
LA1.LA00_CC_P: HPC1 (J15A.g6), FMC_HPC1 (IC2#2.K7)
LA1.LA01_CC_N: HPC1 (J15A.d9), FMC_HPC1 (IC2#2.J5)
LA1.LA01_CC_P: HPC1 (J15A.d8), FMC_HPC1 (IC2#2.J6)
LA1.LA02_N: HPC1 (J15A.h8), FMC_HPC1 (IC2#2.G6)
LA1.LA02_P: HPC1 (J15A.h7), FMC_HPC1 (IC2#2.G7)
LA1.LA03_N: HPC1 (J15A.g10), FMC_HPC1 (IC2#2.G1)
LA1.LA03_P: HPC1 (J15A.g9), FMC_HPC1 (IC2#2.H1)
LA1.LA04_N: HPC1 (J15A.h11), FMC_HPC1 (IC2#2.J1)
LA1.LA04_P: HPC1 (J15A.h10), FMC_HPC1 (IC2#2.K1)
LA1.LA05_N: HPC1 (J15A.d12), FMC_HPC1 (IC2#2.H3)
LA1.LA05_P: HPC1 (J15A.d11), FMC_HPC1 (IC2#2.H4)
LA1.LA06_N: HPC1 (J15A.c11), FMC_HPC1 (IC2#2.K5)
LA1.LA06_P: HPC1 (J15A.c10), FMC_HPC1 (IC2#2.L5)
LA1.LA07_N: HPC1 (J15A.h14), FMC_HPC1 (IC2#2.K2)
LA1.LA07_P: HPC1 (J15A.h13), FMC_HPC1 (IC2#2.K3)
LA1.LA08_N: HPC1 (J15A.g13), FMC_HPC1 (IC2#2.F2)
LA1.LA08_P: HPC1 (J15A.g12), FMC_HPC1 (IC2#2.F3)
LA1.LA09_N: HPC1 (J15A.d15), FMC_HPC1 (IC2#2.J3)
LA1.LA09_P: HPC1 (J15A.d14), FMC_HPC1 (IC2#2.J4)
LA1.LA10_N: HPC1 (J15A.c15), FMC_HPC1 (IC2#2.G2)
LA1.LA10_P: HPC1 (J15A.c14), FMC_HPC1 (IC2#2.H2)
LA1.LA11_N: HPC1 (J15A.h17), FMC_HPC1 (IC2#2.L2)
LA1.LA11_P: HPC1 (J15A.h16), FMC_HPC1 (IC2#2.M2)
LA1.LA12_N: HPC1 (J15A.g16), FMC_HPC1 (IC2#2.K8)
LA1.LA12_P: HPC1 (J15A.g15), FMC_HPC1 (IC2#2.L8)
LA1.LA13_N: HPC1 (J15A.d18), FMC_HPC1 (IC2#2.G9)
LA1.LA13_P: HPC1 (J15A.d17), FMC_HPC1 (IC2#2.G10)
LA1.LA14_N: HPC1 (J15A.c19), FMC_HPC1 (IC2#2.H8)
LA1.LA14_P: HPC1 (J15A.c18), FMC_HPC1 (IC2#2.H9)
LA1.LA15_N: HPC1 (J15A.h20), FMC_HPC1 (IC2#2.J11)
LA1.LA15_P: HPC1 (J15A.h19), FMC_HPC1 (IC2#2.K11)
LA1.LA16_N: HPC1 (J15A.g19), FMC_HPC1 (IC2#2.L9)
LA1.LA16_P: HPC1 (J15A.g18), FMC_HPC1 (IC2#2.L10)
LA1.LA17_CC_N: HPC1 (J15A.d21), FMC_HPC1 (IC2#2.T4)
LA1.LA17_CC_P: HPC1 (J15A.d20), FMC_HPC1 (IC2#2.T5)
LA1.LA18_CC_N: HPC1 (J15A.c23), FMC_HPC1 (IC2#2.P3)
LA1.LA18_CC_P: HPC1 (J15A.c22), FMC_HPC1 (IC2#2.P4)
LA1.LA19_N: HPC1 (J15A.h23), FMC_HPC1 (IC2#2.U4)
LA1.LA19_P: HPC1 (J15A.h22), FMC_HPC1 (IC2#2.U5)
LA1.LA20_N: HPC1 (J15A.g22), FMC_HPC1 (IC2#2.P10)
LA1.LA20_P: HPC1 (J15A.g21), FMC_HPC1 (IC2#2.R10)
LA1.LA21_N: HPC1 (J15A.h26), FMC_HPC1 (IC2#2.M6)
LA1.LA21_P: HPC1 (J15A.h25), FMC_HPC1 (IC2#2.M7)
LA1.LA22_N: HPC1 (J15A.g25), FMC_HPC1 (IC2#2.M4)
LA1.LA22_P: HPC1 (J15A.g24), FMC_HPC1 (IC2#2.M5)
LA1.LA23_N: HPC1 (J15A.d24), FMC_HPC1 (IC2#2.N2)
LA1.LA23_P: HPC1 (J15A.d23), FMC_HPC1 (IC2#2.N3)
LA1.LA24_N: HPC1 (J15A.h29), FMC_HPC1 (IC2#2.M10)
LA1.LA24_P: HPC1 (J15A.h28), FMC_HPC1 (IC2#2.M11)
LA1.LA25_N: HPC1 (J15A.g28), FMC_HPC1 (IC2#2.N7)
LA1.LA25_P: HPC1 (J15A.g27), FMC_HPC1 (IC2#2.N8)
LA1.LA26_N: HPC1 (J15A.d27), FMC_HPC1 (IC2#2.T2)
LA1.LA26_P: HPC1 (J15A.d26), FMC_HPC1 (IC2#2.T3)
LA1.LA27_N: HPC1 (J15A.c27), FMC_HPC1 (IC2#2.R2)
LA1.LA27_P: HPC1 (J15A.c26), FMC_HPC1 (IC2#2.R3)
LA1.LA28_N: HPC1 (J15A.h32), FMC_HPC1 (IC2#2.T7)
LA1.LA28_P: HPC1 (J15A.h31), FMC_HPC1 (IC2#2.T8)
LA1.LA29_N: HPC1 (J15A.g31), FMC_HPC1 (IC2#2.P8)
LA1.LA29_P: HPC1 (J15A.g30), FMC_HPC1 (IC2#2.P9)
LA1.LA30_N: HPC1 (J15A.h35), FMC_HPC1 (IC2#2.M1)
LA1.LA30_P: HPC1 (J15A.h34), FMC_HPC1 (IC2#2.N1)
LA1.LA31_N: HPC1 (J15A.g34), FMC_HPC1 (IC2#2.U6)
LA1.LA31_P: HPC1 (J15A.g33), FMC_HPC1 (IC2#2.U7)
LA1.LA32_N: HPC1 (J15A.h38), FMC_HPC1 (IC2#2.P1)
LA1.LA32_P: HPC1 (J15A.h37), FMC_HPC1 (IC2#2.R1)
LA1.LA33_N: HPC1 (J15A.g37), FMC_HPC1 (IC2#2.U1)
LA1.LA33_P: HPC1 (J15A.g36), FMC_HPC1 (IC2#2.U2)
LA2.LA00_CC_N: HPC2 (J15B.g7), FMC_HPC2 (IC2#2.AF28)
LA2.LA00_CC_P: HPC2 (J15B.g6), FMC_HPC2 (IC2#2.AE28)
LA2.LA01_CC_N: HPC2 (J15B.d9), FMC_HPC2 (IC2#2.AF30)
LA2.LA01_CC_P: HPC2 (J15B.d8), FMC_HPC2 (IC2#2.AF29)
LA2.LA02_N: HPC2 (J15B.h8), FMC_HPC2 (IC2#2.AH31)
LA2.LA02_P: HPC2 (J15B.h7), FMC_HPC2 (IC2#2.AG31)
LA2.LA03_N: HPC2 (J15B.g10), FMC_HPC2 (IC2#2.AH24)
LA2.LA03_P: HPC2 (J15B.g9), FMC_HPC2 (IC2#2.AG24)
LA2.LA04_N: HPC2 (J15B.h11), FMC_HPC2 (IC2#2.AC27)
LA2.LA04_P: HPC2 (J15B.h10), FMC_HPC2 (IC2#2.AC26)
LA2.LA05_N: HPC2 (J15B.d12), FMC_HPC2 (IC2#2.AH34)
LA2.LA05_P: HPC2 (J15B.d11), FMC_HPC2 (IC2#2.AH33)
LA2.LA06_N: HPC2 (J15B.c11), FMC_HPC2 (IC2#2.AF23)
LA2.LA06_P: HPC2 (J15B.c10), FMC_HPC2 (IC2#2.AE23)
LA2.LA07_N: HPC2 (J15B.h14), FMC_HPC2 (IC2#2.AH27)
LA2.LA07_P: HPC2 (J15B.h13), FMC_HPC2 (IC2#2.AG27)
LA2.LA08_N: HPC2 (J15B.g13), FMC_HPC2 (IC2#2.AE25)
LA2.LA08_P: HPC2 (J15B.g12), FMC_HPC2 (IC2#2.AD25)
LA2.LA09_N: HPC2 (J15B.d15), FMC_HPC2 (IC2#2.AG25)
LA2.LA09_P: HPC2 (J15B.d14), FMC_HPC2 (IC2#2.AF25)
LA2.LA10_N: HPC2 (J15B.c15), FMC_HPC2 (IC2#2.AH32)
LA2.LA10_P: HPC2 (J15B.c14), FMC_HPC2 (IC2#2.AG32)
LA2.LA11_N: HPC2 (J15B.h17), FMC_HPC2 (IC2#2.AE30)
LA2.LA11_P: HPC2 (J15B.h16), FMC_HPC2 (IC2#2.AD30)
LA2.LA12_N: HPC2 (J15B.g16), FMC_HPC2 (IC2#2.AF27)
LA2.LA12_P: HPC2 (J15B.g15), FMC_HPC2 (IC2#2.AE27)
LA2.LA13_N: HPC2 (J15B.d18), FMC_HPC2 (IC2#2.AG34)
LA2.LA13_P: HPC2 (J15B.d17), FMC_HPC2 (IC2#2.AF34)
LA2.LA14_N: HPC2 (J15B.c19), FMC_HPC2 (IC2#2.AF33)
LA2.LA14_P: HPC2 (J15B.c18), FMC_HPC2 (IC2#2.AE33)
LA2.LA15_N: HPC2 (J15B.h20), FMC_HPC2 (IC2#2.AD29)
LA2.LA15_P: HPC2 (J15B.h19), FMC_HPC2 (IC2#2.AD28)
LA2.LA16_N: HPC2 (J15B.g19), FMC_HPC2 (IC2#2.AD34)
LA2.LA16_P: HPC2 (J15B.g18), FMC_HPC2 (IC2#2.AD33)
LA2.LA17_CC_N: HPC2 (J15B.d21), FMC_HPC2 (IC2#2.AB32)
LA2.LA17_CC_P: HPC2 (J15B.d20), FMC_HPC2 (IC2#2.AB31)
LA2.LA18_CC_N: HPC2 (J15B.c23), FMC_HPC2 (IC2#2.W31)
LA2.LA18_CC_P: HPC2 (J15B.c22), FMC_HPC2 (IC2#2.W30)
LA2.LA19_N: HPC2 (J15B.h23), FMC_HPC2 (IC2#2.AB27)
LA2.LA19_P: HPC2 (J15B.h22), FMC_HPC2 (IC2#2.AB26)
LA2.LA20_N: HPC2 (J15B.g22), FMC_HPC2 (IC2#2.AB25)
LA2.LA20_P: HPC2 (J15B.g21), FMC_HPC2 (IC2#2.AB24)
LA2.LA21_N: HPC2 (J15B.h26), FMC_HPC2 (IC2#2.AA33)
LA2.LA21_P: HPC2 (J15B.h25), FMC_HPC2 (IC2#2.AA32)
LA2.LA22_N: HPC2 (J15B.g25), FMC_HPC2 (IC2#2.AA25)
LA2.LA22_P: HPC2 (J15B.g24), FMC_HPC2 (IC2#2.AA24)
LA2.LA23_N: HPC2 (J15B.d24), FMC_HPC2 (IC2#2.Y25)
LA2.LA23_P: HPC2 (J15B.d23), FMC_HPC2 (IC2#2.W25)
LA2.LA24_N: HPC2 (J15B.h29), FMC_HPC2 (IC2#2.Y33)
LA2.LA24_P: HPC2 (J15B.h28), FMC_HPC2 (IC2#2.Y32)
LA2.LA25_N: HPC2 (J15B.g28), FMC_HPC2 (IC2#2.AB29)
LA2.LA25_P: HPC2 (J15B.g27), FMC_HPC2 (IC2#2.AA29)
LA2.LA26_N: HPC2 (J15B.d27), FMC_HPC2 (IC2#2.AC32)
LA2.LA26_P: HPC2 (J15B.d26), FMC_HPC2 (IC2#2.AC31)
LA2.LA27_N: HPC2 (J15B.c27), FMC_HPC2 (IC2#2.AA28)
LA2.LA27_P: HPC2 (J15B.c26), FMC_HPC2 (IC2#2.AA27)
LA2.LA28_N: HPC2 (J15B.h32), FMC_HPC2 (IC2#2.W29)
LA2.LA28_P: HPC2 (J15B.h31), FMC_HPC2 (IC2#2.W28)
LA2.LA29_N: HPC2 (J15B.g31), FMC_HPC2 (IC2#2.AC34)
LA2.LA29_P: HPC2 (J15B.g30), FMC_HPC2 (IC2#2.AC33)
LA2.LA30_N: HPC2 (J15B.h35), FMC_HPC2 (IC2#2.W34)
LA2.LA30_P: HPC2 (J15B.h34), FMC_HPC2 (IC2#2.W33)
LA2.LA31_N: HPC2 (J15B.g34), FMC_HPC2 (IC2#2.V32)
LA2.LA31_P: HPC2 (J15B.g33), FMC_HPC2 (IC2#2.V31)
LA2.LA32_N: HPC2 (J15B.h38), FMC_HPC2 (IC2#2.AB34)
LA2.LA32_P: HPC2 (J15B.h37), FMC_HPC2 (IC2#2.AA34)
LA2.LA33_N: HPC2 (J15B.g37), FMC_HPC2 (IC2#2.V34)
LA2.LA33_P: HPC2 (J15B.g36), FMC_HPC2 (IC2#2.V33)
LPC_ISPn: USB_SERIAL_QUAD (IC61.4 R405.1), CPU (SW1.2)
MGT.FP2_CLK1_N: FPGA_MGT (C409.1), Clock_management (IC73.86)
MGT.FP2_CLK1_P: FPGA_MGT (C402.1), Clock_management (IC73.85)
MGT.FP2_CLK2_N: FPGA_MGT (C413.1), Clock_management (IC50#1.4)
MGT.LINK01_CLK_N: FPGA_MGT (C220.1), Clock_management (IC83.2)
MGT.LINK01_CLK_P: FPGA_MGT (C219.1), Clock_management (IC83.1)
MGT.LINK23_CLK_N: FPGA_MGT (C839.1), Clock_management (IC85.2)
MGT.LINK23_CLK_P: FPGA_MGT (C838.1), Clock_management (IC85.1)
MGT.PCIE_CLK1_N: FPGA_MGT (C463.1), Clock_management (IC50#1.2)
MGT.PCIE_CLK1_P: FPGA_MGT (C461.1), Clock_management (IC50#1.1)
MGT.PCIE_CLK2_P: FPGA_MGT (C411.1), Clock_management (IC50#1.3)
MISC1.PG_C2M: HPC1 (J15A.d1), CPU (R17.1 R98.1)
MISC1.PG_M2C: HPC1 (J15A.f1), CPU (R15.1 R100.1)
MISC1.PRSNT: HPC1 (J15A.h2), JTAG_Configuration (R237.2), CPU (R13.1 R102.1)
MISC2.PG_C2M: HPC2 (J15B.d1), CPU (R18.1 R97.1)
MISC2.PG_M2C: HPC2 (J15B.f1), CPU (R16.1 R99.1)
MISC2.PRSNT: HPC2 (J15B.h2), JTAG_Configuration (R241.2), CPU (R14.1 R101.1)
MLVDS_A.Rx17_N: AMC_Connector (P1.141), M-LVDS PHY (IC22.14)
MLVDS_A.Rx17_P: AMC_Connector (P1.142), M-LVDS PHY (IC22.13)
MLVDS_A.Rx18_N: AMC_Connector (P1.147), M-LVDS PHY (IC22.4)
MLVDS_A.Rx18_P: AMC_Connector (P1.148), M-LVDS PHY (IC22.3)
MLVDS_A.Rx19_N: AMC_Connector (P1.153), M-LVDS PHY (IC23.14)
MLVDS_A.Rx19_P: AMC_Connector (P1.154), M-LVDS PHY (IC23.13)
MLVDS_A.Rx20_N: AMC_Connector (P1.159), M-LVDS PHY (IC23.4)
MLVDS_A.Rx20_P: AMC_Connector (P1.160), M-LVDS PHY (IC23.3)
MLVDS_A.Tx17_N: AMC_Connector (P1.144), M-LVDS PHY (IC22.10)
MLVDS_A.Tx17_P: AMC_Connector (P1.145), M-LVDS PHY (IC22.9)
MLVDS_A.Tx18_N: AMC_Connector (P1.150), M-LVDS PHY (IC22.48)
MLVDS_A.Tx18_P: AMC_Connector (P1.151), M-LVDS PHY (IC22.47)
MLVDS_A.Tx19_N: AMC_Connector (P1.156), M-LVDS PHY (IC23.10)
MLVDS_A.Tx19_P: AMC_Connector (P1.157), M-LVDS PHY (IC23.9)
MLVDS_A.Tx20_N: AMC_Connector (P1.162), M-LVDS PHY (IC23.48)
MLVDS_A.Tx20_P: AMC_Connector (P1.163), M-LVDS PHY (IC23.47)
MLVDS_F.IO_RX_P17: FPGA_SDRAM (IC2#2.AM9), M-LVDS PHY (IC28.3)
MLVDS_F.IO_RX_P18: FPGA_SDRAM (IC2#2.AP10), M-LVDS PHY (IC34.3)
MLVDS_F.IO_RX_P19: FPGA_SDRAM (IC2#2.AN8), M-LVDS PHY (IC36.3)
MLVDS_F.IO_RX_P20: FPGA_SDRAM (IC2#2.AL8), M-LVDS PHY (IC38.3)
MLVDS_F.IO_TX_P17: FPGA_SDRAM (IC2#2.AP11), M-LVDS PHY (IC29.3)
MLVDS_F.IO_TX_P18: FPGA_SDRAM (IC2#2.AM11), M-LVDS PHY (IC35.3)
MLVDS_F.IO_TX_P19: FPGA_SDRAM (IC2#2.AP8), M-LVDS PHY (IC37.3)
MLVDS_F.IO_TX_P20: FPGA_SDRAM (IC2#2.AL9), M-LVDS PHY (IC39.3)
MLVDS_F.~{RE}_DE_RX_P17: FPGA_SDRAM (IC2#2.AJ10), M-LVDS PHY (IC28.5 IC40.10)
MLVDS_F.~{RE}_DE_RX_P18: FPGA_SDRAM (IC2#2.AJ11), M-LVDS PHY (IC34.5 IC40.8)
MLVDS_F.~{RE}_DE_RX_P19: FPGA_SDRAM (IC2#2.AM10), M-LVDS PHY (IC36.5 IC40.6)
MLVDS_F.~{RE}_DE_RX_P20: FPGA_SDRAM (IC2#2.AN9), M-LVDS PHY (IC38.5 IC40.4)
MLVDS_F.~{RE}_DE_TX_P17: FPGA_SDRAM (IC2#2.AK11), M-LVDS PHY (IC29.5 IC40.9)
MLVDS_F.~{RE}_DE_TX_P18: FPGA_SDRAM (IC2#2.AL10), M-LVDS PHY (IC35.5 IC40.7)
MLVDS_F.~{RE}_DE_TX_P19: FPGA_SDRAM (IC2#2.AN11), M-LVDS PHY (IC37.5 IC40.5)
MLVDS_F.~{RE}_DE_TX_P20: FPGA_SDRAM (IC2#2.AP9), M-LVDS PHY (IC39.5 IC40.3)
MMC_CONS_PROG_RxD: USB_SERIAL_QUAD (IC61.2), CPU (IC1.99)
MMC_CONS_PROG_TxD: USB_SERIAL_QUAD (IC61.3), CPU (IC1.98)
MMC_TCK: JTAG_Configuration (IC46.11), CPU (R139.2)
MMC_TDI: JTAG_Configuration (IC46.2), CPU (R118.2)
MMC_TDO: JTAG_Configuration (IC46.5), CPU (R60.2)
MMC_TMS: JTAG_Configuration (IC46.14), CPU (R56.2)
MMC_TRSTn: JTAG_Configuration (R229.1), CPU (R1.2)
NetIC2#1_W17: FPGA (IC2#1.W17), Thermometers (R135.1)
NetIC2#1_W18: FPGA (IC2#1.W18), Thermometers (IC18.3)
OVERTEMPn: Thermometers (6 pins), CPU (IC1.52)
PIPE1.Rx4_N: AMC_Connector (P1.48), FPGA_MGT (C337.1)
PIPE1.Rx4_P: AMC_Connector (P1.47), FPGA_MGT (C336.1)
PIPE1.Rx5_N: AMC_Connector (P1.54), FPGA_MGT (C341.1)
PIPE1.Rx5_P: AMC_Connector (P1.53), FPGA_MGT (C340.1)
PIPE1.Rx6_N: AMC_Connector (P1.63), FPGA_MGT (C349.1)
PIPE1.Rx6_P: AMC_Connector (P1.62), FPGA_MGT (C348.1)
PIPE1.Rx7_N: AMC_Connector (P1.69), FPGA_MGT (C345.1)
PIPE1.Rx7_P: AMC_Connector (P1.68), FPGA_MGT (C344.1)
PIPE1.Tx4_N: AMC_Connector (P1.45), FPGA_MGT (C335.1)
PIPE1.Tx4_P: AMC_Connector (P1.44), FPGA_MGT (C334.1)
PIPE1.Tx5_N: AMC_Connector (P1.51), FPGA_MGT (C339.1)
PIPE1.Tx5_P: AMC_Connector (P1.50), FPGA_MGT (C338.1)
PIPE1.Tx6_N: AMC_Connector (P1.60), FPGA_MGT (C347.1)
PIPE1.Tx6_P: AMC_Connector (P1.59), FPGA_MGT (C346.1)
PIPE1.Tx7_N: AMC_Connector (P1.66), FPGA_MGT (C343.1)
PIPE1.Tx7_P: AMC_Connector (P1.65), FPGA_MGT (C342.1)
PIPE2.Rx8_N: AMC_Connector (P1.87), FPGA_MGT (C321.1)
PIPE2.Rx8_P: AMC_Connector (P1.88), FPGA_MGT (C320.1)
PIPE2.Rx9_N: AMC_Connector (P1.93), FPGA_MGT (C325.1)
PIPE2.Rx9_P: AMC_Connector (P1.94), FPGA_MGT (C324.1)
PIPE2.Rx10_N: AMC_Connector (P1.99), FPGA_MGT (C329.1)
PIPE2.Rx10_P: AMC_Connector (P1.100), FPGA_MGT (C328.1)
PIPE2.Rx11_N: AMC_Connector (P1.105), FPGA_MGT (C333.1)
PIPE2.Rx11_P: AMC_Connector (P1.106), FPGA_MGT (C332.1)
PIPE2.Tx8_N: AMC_Connector (P1.90), FPGA_MGT (C319.1)
PIPE2.Tx8_P: AMC_Connector (P1.91), FPGA_MGT (C318.1)
PIPE2.Tx9_N: AMC_Connector (P1.96), FPGA_MGT (C323.1)
PIPE2.Tx9_P: AMC_Connector (P1.97), FPGA_MGT (C322.1)
PIPE2.Tx10_N: AMC_Connector (P1.102), FPGA_MGT (C327.1)
PIPE2.Tx10_P: AMC_Connector (P1.103), FPGA_MGT (C326.1)
PIPE2.Tx11_N: AMC_Connector (P1.108), FPGA_MGT (C331.1)
PIPE2.Tx11_P: AMC_Connector (P1.109), FPGA_MGT (C330.1)
PLL_CTRL.PLL_VADJ2_DAC1_SYNC_N: FMC_HPC2 (IC2#2.R25), Clock_management (IC41.5)
PLL_CTRL.PLL_VADJ2_DAC2_SYNC_N: FMC_HPC2 (IC2#2.AL24), Clock_management (IC41.3)
PLL_CTRL.PLL_VADJ2_DAC_DIN: FMC_HPC2 (IC2#2.AF24), Clock_management (IC41.6)
PLL_CTRL.PLL_VADJ2_DAC_SCLK: FMC_HPC2 (IC2#2.AJ24), Clock_management (IC41.4)
PLL_CTRL.VADJ2_Helper_TUNE: FMC_HPC2 (IC2#2.U24), Clock_management (IC41.9)
PLL_CTRL.VADJ2_SI57X_OE: FMC_HPC2 (IC2#2.AD23), Clock_management (IC41.7)
PLL_CTRL.VADJ2_SI57X_SCL: FMC_HPC2 (IC2#2.V24), Clock_management (IC42.3 R214.2)
PLL_CTRL.VADJ2_SI57X_SDA: FMC_HPC2 (IC2#2.W24), Clock_management (IC42.4 R271.2)
PLL_CTRL.VADJ2_SI57X_TUNE: FMC_HPC2 (IC2#2.T24), Clock_management (IC41.8)
PLL_DAC1_SYNC_N: Clock_management (IC41.19), Clock_WR (IC53.5)
PLL_DAC2_SYNC_N: Clock_management (IC41.21), Clock_WR (IC52.5)
PLL_DAC_DIN: Clock_management (IC41.18), Clock_WR (IC52.7 IC53.7 IC82.7)
PLL_DAC_SCLK: Clock_management (IC41.20), Clock_WR (IC52.6 IC53.6 IC82.6)
PM.1V5_VTT_EN: SUP_1.5_3.3 (IC43.24 R49.1), CPU (IC66.13)
PM.DAC_VADJ_CLK: SUP_2.5_FMC (IC11.9), CPU (IC1.62)
PM.DAC_VADJ_CSn: SUP_2.5_FMC (IC11.7), CPU (IC1.63)
PM.DAC_VADJ_RSTn: SUP_2.5_FMC (IC11.10), CPU (IC1.57)
PM.DAC_VADJ_SDI: SUP_2.5_FMC (IC11.8), CPU (IC1.60)
PM.EN_FMC1_P3V3: SUP_3.3_FMC (IC12.7 R92.1), CPU (IC66.2)
PM.EN_FMC1_PVADJ: SUP_2.5_FMC (IC10.7 R78.1), CPU (IC66.4)
PM.EN_FMC2_P3V3: SUP_3.3_FMC (IC12.24 R85.1), CPU (IC66.28)
PM.EN_FMC2_P12V: POWER_Management (Q4.1 R40.2), CPU (IC66.5)
PM.EN_FMC2_PVADJ: SUP_2.5_FMC (IC10.24 R71.1), CPU (IC66.3)
PM.EN_P1V0: SUP_1V (IC14.2 R114.2), CPU (IC66.27)
PM.EN_P1V2: SUP_1.2_1.8 (R103.1 R119.2), CPU (IC66.11)
PM.EN_P1V8: SUP_1.2_1.8 (R61.1 R120.2), CPU (IC66.12)
PM.EN_P3V3: SUP_1.5_3.3 (IC43.7 R69.1), CPU (IC66.26)
PM.EN_RTM_MP: POWER_Management (R67.2 T10.1), CPU (IC66.24)
PM.EN_RTM_PWR: POWER_Management (R305.2 T14#1.1), CPU (IC66.25)
PM.PGOOD_P1V0: POWER_Management (C20.1 IC58.3 R268.1), SUP_1.5_3.3 (IC44.9), SUP_1.2_1.8 (R289.1 R290.1), SUP_1V (IC14.3 R110.1), CPU (IC1.26)
PM_I2C.SCL: UI_mon (IC6.6 IC7.6 IC8.6), I2C_MUX (IC62.8 IC63.8 R265.2)
PM_I2C.SDA: UI_mon (IC6.7 IC7.7 IC8.5 IC8.7), I2C_MUX (IC62.7 IC63.7 R147.2)
PORT0.Rx0_N: AMC_Connector (P1.15), FPGA_MGT (C224.1 C884.1)
PORT0.Rx0_P: AMC_Connector (P1.14), FPGA_MGT (C223.1 C883.1)
PORT0.Tx0_N: AMC_Connector (P1.12), FPGA_MGT (C222.1 C885.1)
PORT0.Tx0_P: AMC_Connector (P1.11), FPGA_MGT (C221.1 C886.1)
PORT1.Rx1_N: AMC_Connector (P1.24), FPGA_MGT (C625.1)
PORT1.Rx1_P: AMC_Connector (P1.23), FPGA_MGT (C228.1)
PORT1.Tx1_N: AMC_Connector (P1.21), FPGA_MGT (C227.1)
PORT1.Tx1_P: AMC_Connector (P1.20), FPGA_MGT (C225.1)
PORT2.Rx2_N: AMC_Connector (P1.33), AMC-SATA (C213.2 C760.2)
PORT2.Rx2_P: AMC_Connector (P1.32), AMC-SATA (C214.2 C761.2)
PORT2.Tx2_N: AMC_Connector (P1.30), AMC-SATA (C212.2 C759.2)
PORT2.Tx2_P: AMC_Connector (P1.29), AMC-SATA (C211.2 C758.2)
PORT3.Rx3_N: AMC_Connector (P1.39), AMC-SATA (C217.2 C756.2 C820.2)
PORT3.Rx3_P: AMC_Connector (P1.38), AMC-SATA (C218.2 C757.2 C821.2)
PORT3.Tx3_N: AMC_Connector (P1.36), AMC-SATA (C216.2 C755.2 C819.2)
PORT3.Tx3_P: AMC_Connector (P1.35), AMC-SATA (C215.2 C754.2 C818.2)
POWER1.3P3VAUX: HPC1 (C16A.1 C17A.1 J15A.d32), POWER_Management (F1.2 R343.2)
POWER1.12P0V: HPC1 (7 pins), POWER_Management (R41.2 R266.I2)
POWER2.3P3VAUX: AMC_FMC_Carrier (R124.1), HPC2 (C16B.1 C17B.1 J15B.d32), POWER_Management (F2.2 R344.2)
POWER2.12P0V: HPC2 (7 pins), POWER_Management (R42.2 R267.I2)
PRI_UART_Rx: FPGA (IC45.11), USB_SERIAL_QUAD (R348.1)
PRI_UART_Tx: FPGA (IC45.10), USB_SERIAL_QUAD (R394.1)
PRI_UART_VADJ2_Rx: FPGA (IC45.4), FMC_HPC2 (IC2#2.AD26 TP15.1)
PRI_UART_VADJ2_Tx: FPGA (IC45.5), FMC_HPC2 (IC2#2.AE26 TP14.1)
PVADJ2_IO8: FPGA (IC70.3), FMC_HPC2 (IC2#2.AC28)
PVADJ2_IO9: FPGA (IC70.4), FMC_HPC2 (IC2#2.Y26)
PVADJ2_IO10: FPGA (IC70.5), FMC_HPC2 (IC2#2.T32)
PVADJ2_IO11: FPGA (IC70.2), FMC_HPC2 (IC2#2.AE31)
PWRA: POWER_Management (R68.I2), RTM_CON (J1.a1 J1.a2 J1.b1 J1.b2)
RESETn: POWER_Management (IC58.2 R269.1), Clock_management (IC73.22), CPU (IC1.36)
RTM_CLK_N: RTM_CON (J1.d3), Clock_management (R29.1)
RTM_CLK_P: RTM_CON (J1.c3), Clock_management (R27.1)
RTM_GTP03_N: RTM_CON (J2.b10), Clock_management (IC83.4)
RTM_GTP03_P: RTM_CON (J2.a10), Clock_management (IC83.3)
RTM_GTP47_N: RTM_CON (J2.b6), Clock_management (IC85.4)
RTM_GTP47_P: RTM_CON (J2.a6), Clock_management (IC85.3)
RTM_JTAG_Override: JTAG_Configuration (D25.2), CPU (IC1.75)
RTM_LVD3_N: FPGA (R323.1), FMC_HPC1 (IC2#2.K12)
RTM_LVD3_P: FPGA (R322.1), FMC_HPC1 (IC2#2.L12)
RTM_LVD4_N: FPGA (R324.1), FMC_HPC1 (IC2#2.G11)
RTM_LVD4_P: FPGA (R325.1), FMC_HPC1 (IC2#2.H11)
RTM_MP: POWER_Management (F4.2), RTM_CON (J1.c2)
RTM_PS#: JTAG_Configuration (R242.2), RTM_CON (J1.c1), CPU (D1.1 R31.1 R32.2)
RTM_TCK: JTAG_Configuration (IC47.15), RTM_CON (J1.e1)
RTM_TDI: JTAG_Configuration (IC72.4 IC75.1), RTM_CON (J1.e2)
RTM_TDO: JTAG_Configuration (IC75.3), RTM_CON (J1.f1)
RTM_TMS: JTAG_Configuration (IC47.12), RTM_CON (J1.f2)
Rx2C_N: FPGA_MGT (C512.2), AMC-SATA (C760.1)
Rx2C_P: FPGA_MGT (C455.2), AMC-SATA (C761.1)
Rx3C_N: FPGA_MGT (C751.2), AMC-SATA (C756.1)
Rx3C_P: FPGA_MGT (C590.2), AMC-SATA (C757.1)
Rx3LVDS_N: FPGA (R323.2), AMC-SATA (C820.1)
Rx3LVDS_P: FPGA (R322.2), AMC-SATA (C821.1)
Rx12_N: AMC_Connector (P1.111), FPGA_MGT (C825.1)
Rx12_P: AMC_Connector (P1.112), FPGA_MGT (C824.1)
Rx13_N: AMC_Connector (P1.117), FPGA_MGT (C833.1)
Rx13_P: AMC_Connector (P1.118), FPGA_MGT (C832.1)
Rx14_N: AMC_Connector (P1.123), FPGA_MGT (C829.1)
Rx14_P: AMC_Connector (P1.124), FPGA_MGT (C828.1)
Rx15_N: AMC_Connector (P1.129), FPGA_MGT (C837.1)
Rx15_P: AMC_Connector (P1.130), FPGA_MGT (C836.1)
SCL: I2C_MUX (IC62.4 IC63.4 R416.2), RTCE (IC9.6 IC27.6)
SCL0: I2C_MUX (IC62.2 IC63.2 R414.2), Thermometers (5 pins)
SCL5: RTM_CON (J1.d2), I2C_MUX (IC62.13 IC63.13 R426.2)
SCN_ENn: AMC_Connector (P1.41), CPU (5 pins)
SDA: I2C_MUX (IC62.3 IC63.3 R415.2), RTCE (IC9.5 IC27.5)
SDA0: I2C_MUX (IC62.1 IC63.1 R413.2), Thermometers (5 pins)
SDA5: RTM_CON (J1.d1), I2C_MUX (IC62.12 IC63.12 R425.2)
SFP_GTP.SFP1RX_N: FPGA_MGT (C800.1), RTM_CON (J2.d10)
SFP_GTP.SFP1RX_P: FPGA_MGT (C798.1), RTM_CON (J2.c10)
SFP_GTP.SFP1TX_N: FPGA_MGT (C796.1), RTM_CON (J2.f10)
SFP_GTP.SFP1TX_P: FPGA_MGT (C795.1), RTM_CON (J2.e10)
SFP_GTP.SFP2RX_N: FPGA_MGT (C804.1), RTM_CON (J2.d9)
SFP_GTP.SFP2RX_P: FPGA_MGT (C803.1), RTM_CON (J2.c9)
SFP_GTP.SFP2TX_N: FPGA_MGT (C802.1), RTM_CON (J2.f9)
SFP_GTP.SFP2TX_P: FPGA_MGT (C801.1), RTM_CON (J2.e9)
SFP_GTP.SFP3RX_N: FPGA_MGT (C808.1), RTM_CON (J2.d8)
SFP_GTP.SFP3RX_P: FPGA_MGT (C807.1), RTM_CON (J2.c8)
SFP_GTP.SFP3TX_N: FPGA_MGT (C806.1), RTM_CON (J2.f8)
SFP_GTP.SFP3TX_P: FPGA_MGT (C805.1), RTM_CON (J2.e8)
SFP_GTP.SFP4RX_N: FPGA_MGT (C812.1), RTM_CON (J2.d7)
SFP_GTP.SFP4RX_P: FPGA_MGT (C811.1), RTM_CON (J2.c7)
SFP_GTP.SFP4TX_N: FPGA_MGT (C810.1), RTM_CON (J2.f7)
SFP_GTP.SFP4TX_P: FPGA_MGT (C809.1), RTM_CON (J2.e7)
SFP_GTP.SFP5RX_N: FPGA_MGT (C793.1), RTM_CON (J2.d6)
SFP_GTP.SFP5RX_P: FPGA_MGT (C791.1), RTM_CON (J2.c6)
SFP_GTP.SFP5TX_N: FPGA_MGT (C790.1), RTM_CON (J2.f6)
SFP_GTP.SFP5TX_P: FPGA_MGT (C789.1), RTM_CON (J2.e6)
SFP_GTP.SFP6RX_N: FPGA_MGT (C780.1), RTM_CON (J2.d5)
SFP_GTP.SFP6RX_P: FPGA_MGT (C779.1), RTM_CON (J2.c5)
SFP_GTP.SFP6TX_N: FPGA_MGT (C778.1), RTM_CON (J2.f5)
SFP_GTP.SFP6TX_P: FPGA_MGT (C777.1), RTM_CON (J2.e5)
SFP_GTP.SFP7RX_N: FPGA_MGT (C784.1), RTM_CON (J2.d4)
SFP_GTP.SFP7RX_P: FPGA_MGT (C783.1), RTM_CON (J2.c4)
SFP_GTP.SFP7TX_N: FPGA_MGT (C782.1), RTM_CON (J2.f4)
SFP_GTP.SFP7TX_P: FPGA_MGT (C781.1), RTM_CON (J2.e4)
SFP_GTP.SFP8RX_N: FPGA_MGT (C788.1), RTM_CON (J2.d3)
SFP_GTP.SFP8RX_P: FPGA_MGT (C787.1), RTM_CON (J2.c3)
SFP_GTP.SFP8TX_N: FPGA_MGT (C786.1), RTM_CON (J2.f3)
SFP_GTP.SFP8TX_P: FPGA_MGT (C785.1), RTM_CON (J2.e3)
SI57X_OE: Clock_management (IC41.17), Clock_WR (OSC4.2 Q8.1 R223.1)
SI57X_SCL: Clock_management (IC42.6), Clock_WR (OSC4.8 R220.1)
SI57X_SDA: Clock_management (IC42.5), Clock_WR (OSC4.7 R272.1)
SI57X_TUNE: Clock_management (IC41.16), Clock_WR (R224.2 R353.2)
SYNC_CLK_C_N: Clock_management (IC73.36), Clock_WR (IC48.5 OSC4.5)
SYNC_CLK_C_P: Clock_management (IC73.35), Clock_WR (IC48.6 OSC4.4)
TCLKA_N: AMC_Connector (P1.75), Clock_management (C397.2)
TCLKA_P: AMC_Connector (P1.74), Clock_management (C399.2)
TCLKB_N: AMC_Connector (P1.78), Clock_management (IC73.70)
TCLKB_P: AMC_Connector (P1.77), Clock_management (IC73.69)
TCLKC_N: AMC_Connector (P1.135), Clock_management (IC73.61)
TCLKC_P: AMC_Connector (P1.136), Clock_management (IC73.60)
TCLKD_N: AMC_Connector (P1.138), Clock_management (IC73.57)
TCLKD_P: AMC_Connector (P1.139), Clock_management (IC73.56)
Tx2C_N: FPGA_MGT (C514.2), AMC-SATA (C759.1)
Tx2C_P: FPGA_MGT (C575.2), AMC-SATA (C758.1)
Tx3C_N: FPGA_MGT (C752.2), AMC-SATA (C755.1)
Tx3C_P: FPGA_MGT (C753.2), AMC-SATA (C754.1)
Tx3LVDS_N: FPGA (R324.2), AMC-SATA (C819.1)
Tx3LVDS_P: FPGA (R325.2), AMC-SATA (C818.1)
Tx12_N: AMC_Connector (P1.114), FPGA_MGT (C823.1)
Tx12_P: AMC_Connector (P1.115), FPGA_MGT (C822.1)
Tx13_N: AMC_Connector (P1.120), FPGA_MGT (C831.1)
Tx13_P: AMC_Connector (P1.121), FPGA_MGT (C830.1)
Tx14_N: AMC_Connector (P1.126), FPGA_MGT (C827.1)
Tx14_P: AMC_Connector (P1.127), FPGA_MGT (C826.1)
Tx15_N: AMC_Connector (P1.132), FPGA_MGT (C835.1)
Tx15_P: AMC_Connector (P1.133), FPGA_MGT (C834.1)
USB_JTAG_ACTIVE: JTAG_Configuration (T8.1), USB_SERIAL_QUAD (R336.2)
USB_TCK: JTAG_Configuration (R226.2), USB_SERIAL_QUAD (IC20.4)
USB_TDI: JTAG_Configuration (R227.2), USB_SERIAL_QUAD (IC20.5)
USB_TDO: JTAG_Configuration (R230.2), USB_SERIAL_QUAD (IC56.4)
USB_TMS: JTAG_Configuration (R232.2), USB_SERIAL_QUAD (IC56.5)
VADJ1_IO0: FPGA (IC68.5), FMC_HPC1 (IC2#2.M26)
VADJ1_IO1: FPGA (IC68.4), FMC_HPC1 (IC2#2.L23)
VADJ1_IO2: FPGA (IC68.3), FMC_HPC1 (IC2#2.W6)
VADJ1_IO3: FPGA (IC68.2), FMC_HPC1 (IC2#2.AA8)
VADJ1_IO4: FPGA (IC69.2), FMC_HPC1 (IC2#2.U11)
VADJ1_IO5: FPGA (IC69.3), FMC_HPC1 (IC2#2.R8)
VADJ1_IO6: FPGA (IC69.4), FMC_HPC1 (IC2#2.L4)
VREF1.VREF_A_M2C: HPC1 (J15A.h1), FMC_HPC1 (8 pins)
VREF1.VREF_B_M2C: HPC1 (J15A.k1), FMC_HPC1 (C114.1 C121.1 IC2#2.AA7 IC2#2.Y6)
VREF2.VREF_A_M2C: HPC2 (J15B.h1), FMC_HPC2 (8 pins)
VREF2.VREF_B_M2C: HPC2 (J15B.k1), FMC_HPC2 (C129.1 C392.1 IC2#2.P25 IC2#2.R32)

## Assembly variants
Default: not fitted C178 C179 C180 C181 C182 C183 C184 C185 C186 C187 C188 C189 C190 C191 C192 C193 C194 C195 C196 C197 C198 C199 C200 C201 C202 C203 C204 C205 C206 C207 C211 C212 C213 C214 C215 C216 C217 C218 C318 C319 C320 C321 C322 C323 C324 C325 C326 C327 C328 C329 C330 C331 C332 C333 C434 C626 C627 C628 C629 C630 C631 C632 C633 C818 C819 C820 C821 C822 C823 C824 C825 C826 C827 C828 C829 C830 C831 C832 C833 C834 C835 C836 C837 C840 C841 J22 J23 OSC2 R28 R51 R67 R68 R128 R134 R138 R208 R217 R221 R? R? R? R? R? R?